# Altium project 24V 20CH ESP32 Actuator Controller.PrjPcb (part 1 of 2)
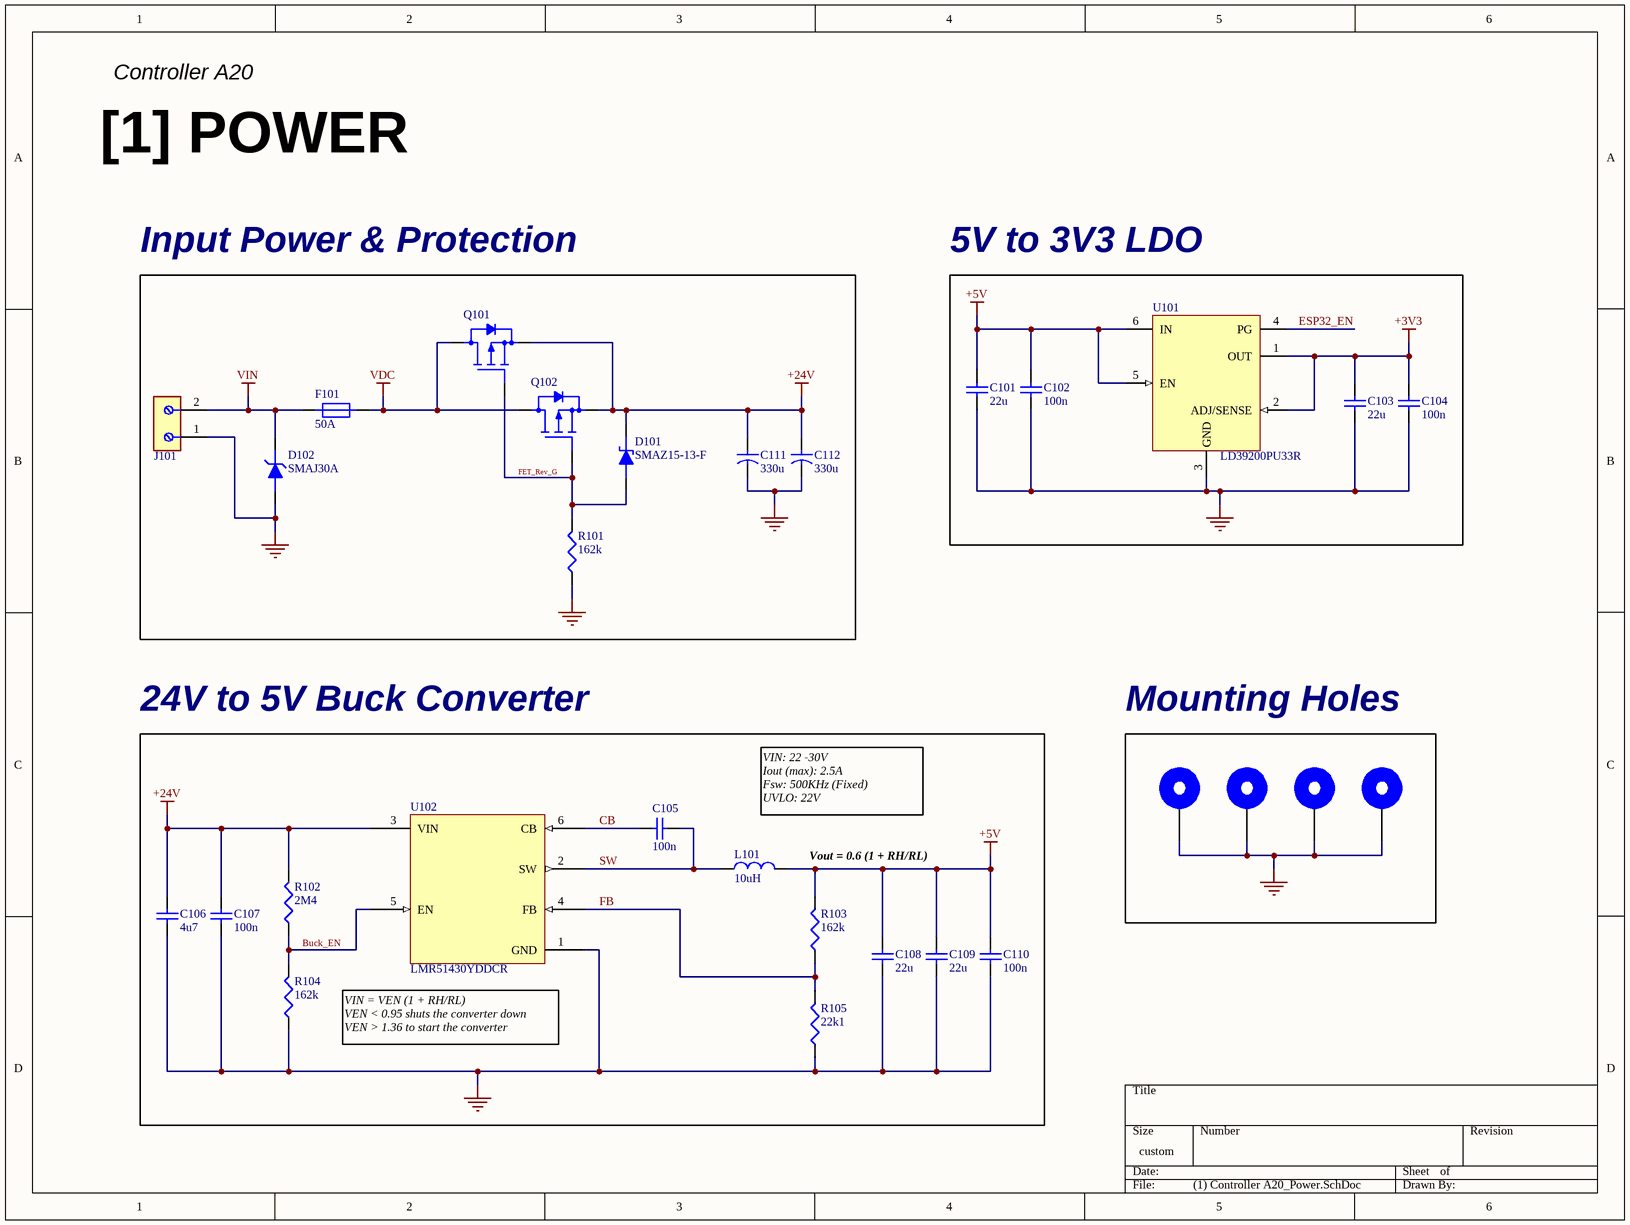
[diagram p0: (1) Controller A20_Power.SchDoc]
6 sheets, 205 parts. Net scope: global (net labels, ports and power ports of the same name join across sheets).
Board file: Controller A20.PcbDoc
Sheets:
  (1) Controller A20_Power.SchDoc
  (2) Controller A20_ESP32.SchDoc
  (3) Controller A20_Ethernet.SchDoc
  (4) Controller A20_BUFFERs.SchDoc
  (5) Controller A20_SSRs.SchDoc
  (6) Controller A20_OUTPUT.SchDoc

## Sheet (1) Controller A20_Power.SchDoc
size 304 x 228 mm; SheetNumber: 1; SheetTotal: 6

### Parts
C101  22u  [C0805]
C102  100n  [C0603]
C103  22u  [C0805]
C104  100n  [C0603]
C105  100n  [C0603]
C106  4u7  [C0805]
C107  100n  [C0603]
C108  22u  [C0805]
C109  22u  [C0805]
C110  100n  [C0603]
C111  330u  [SMD CAP,D10.3xL10.3mm]
C112  330u  [SMD CAP,D10.3xL10.3mm]
D101  SMAZ15-13-F  [DO-214AC(SMA)]
D102  SMAJ30A  [DO-214AC(SMA)]
F101  50A  [SMD Fuse,12.2 x 4.5 x 4.5 mm]
J101  691256610002  [10.16mm 2P STB]  (value not drawn)
J102  Mounting Hole D6mm H3mm  [MH D6mm H3mm]  (value not drawn)
J103  Mounting Hole D6mm H3mm  [MH D6mm H3mm]  (value not drawn)
J104  Mounting Hole D6mm H3mm  [MH D6mm H3mm]  (value not drawn)
J105  Mounting Hole D6mm H3mm  [MH D6mm H3mm]  (value not drawn)
L101  10uH  [L SMD 6.8x6.6]
Q101  XPH3R114MC,L1XHQ  [8-SOP Advance (5x5)]  (value not drawn)
Q102  XPH3R114MC,L1XHQ  [8-SOP Advance (5x5)]  (value not drawn)
R101  162k  [R0603]
R102  2M4  [R0603]
R103  162k  [R0603]
R104  162k  [R0603]
R105  22k1  [R0603]
U101  LD39200PU33R  [DFN-6(3x3)]
U102  LMR51430YDDCR  [SOT-23-6]

### Blocks framed on the sheet
Input Power & Protection: C111 C112 D101 D102 F101 J101 Q101 Q102 R101
5V to 3V3 LDO: C101-C104 U101
24V to 5V Buck Converter: C105-C110 L101 R102-R105 U102
Mounting Holes: J102-J105

### Nets
+3V3: C103.2 C104.2 U101.1(OUT) U101.2(ADJ/SENSE)
+5V: C101.2 C102.2 C108.2 C109.2 C110.2 L101.2 R103.2 U101.5(EN) U101.6(IN)
+24V: C106.2 C107.2 C111.1 C112.1 D101.2 Q101.1 Q102.1 R102.2 U102.3(VIN)
GND: C101.1 C102.1 C103.1 C104.1 C106.1 C107.1 C108.1 C109.1 C110.1 C111.2 C112.2 D102.1 J101.1 J102.1 J103.1 J104.1 J105.1 R101.1 R104.1 R105.1 U101.3(GND) U102.1(GND)
VDC: F101.1 Q101.5 Q102.5
VIN: D102.2 F101.2 J101.2
Buck_EN: R102.1 R104.2 U102.5(EN)
CB: C105.1 U102.6(CB)
ESP32_EN: U101.4(PG)
FB: R103.1 R105.2 U102.4(FB)
FET_Rev_G: D101.1 Q101.4 Q102.4 R101.2
SW: C105.2 L101.1 U102.2(SW)

### Notes on the sheet
- Controller A20
- [1] POWER
- VIN: 22 -30V
  Iout (max): 2.5A
  Fsw: 500KHz (Fixed)
  UVLO: 22V
- (near L101) Vout = 0.6 (1 + RH/RL)
- VIN = VEN (1 + RH/RL)
  VEN < 0.95 shuts the converter down
  VEN > 1.36 to start the converter

### Library data of the parts
C101 C103 C108 C109 = CAP 22uF 25V: 22 µF ±20% 25V Ceramic Capacitor X5R 0805 (2012 Metric); Manufacturer: Samsung Electro-Mechanics; Mfr. Part #: CL21A226MAYNNNE; Qty.: 10; Ext. Price: 0.43; Supplier: DigiKey; Supplier Part #: 1276-CL21A226MAYNNNECT-ND; Package: 0805; Unit Price: 0.043; ComponentLink1Description: Datasheet; ComponentLink1URL: https://mm.digikey.com/Volume0/opasdata/d220001/medias/docus/339/CL21A226MAYNNNE_Spec.pdf; ComponentLink2Description: Distributor Link; ComponentLink2URL: https://www.digikey.com/en/products/detail/samsung-electro-mechanics/CL21A226MAYNNNE/10479857
C102 C104 C105 C107 C110 = CAP 100nF 50V: 0.1 µF ±10% 50V Ceramic Capacitor X7R 0603 (1608 Metric); Manufacturer: KEMET; Mfr. Part #: C0603C104K5RACTU; Qty.: 10; Ext. Price: 0.11; Supplier: DigiKey; Supplier Part #: 399-C0603C104K5RACTUCT-ND; Package: 0603; Unit Price: 0.011; ComponentLink1Description: Datasheet; ComponentLink1URL: https://www.yageogroup.com/content/datasheet/asset/file/KEM_C1002_X7R_SMD; ComponentLink2Description: Distributor Link; ComponentLink2URL: https://www.digikey.com/en/products/detail/kemet/C0603C104K5RACTU/1465594
C106 = CAP 4.7uF 50V: 4.7 µF ±20% 50V Ceramic Capacitor X7R 0805 (2012 Metric); Manufacturer: Murata Electronics; Mfr. Part #: GRM21BZ71H475ME15K; Qty.: 1; Ext. Price: 0.27; Supplier: DigiKey; Supplier Part #: 490-GRM21BZ71H475ME15KCT-ND; Package: 0805; Unit Price: 0.27; ComponentLink1Description: Datasheet; ComponentLink1URL: https://search.murata.co.jp/Ceramy/image/img/A01X/G101/ENG/GRM21BZ71H475ME15-01.pdf; ComponentLink2Description: Distributor Link; ComponentLink2URL: https://www.digikey.com/en/products/detail/murata-electronics/GRM21BZ71H475ME15K/13904866
C111 C112 = Electrolytic CAP 330uF 50V: 330 µF 50 V Aluminum Electrolytic Capacitors Radial, Can - SMD 2000 Hrs @ 105°C; Manufacturer: Nichicon; Mfr. Part #: UCM1H331MNL1GS; Qty.: 1; Ext. Price: 1.18; Supplier: DigiKey; Supplier Part #: 493-14535-1-ND; Package: SMD,D10.3xL10.3mm; Unit Price: 1.18; ComponentLink1Description: Datasheet; ComponentLink1URL: https://www.nichicon.co.jp/english/series_items/catalog_pdf/e-ucm.pdf; ComponentLink2Description: Distributor Link; ComponentLink2URL: https://www.digikey.com/en/products/detail/nichicon/UCM1H331MNL1GS/4991858
D101 = SMAZ15-13-F 15V Zener Diode: Zener Diode 15 V 1 W ±5% Surface Mount SMA; Manufacturer: Diodes Incorporated; Qty.: 1; Ext. Price: 0.28; Mfr. Part #: SMAZ15-13-F; Supplier: DigiKey; Supplier Part #: SMAZ15-FDICT-ND; Package: DO-214AC(SMA); Unit Price: 0.28; ComponentLink1Description: Datasheet; ComponentLink1URL: https://www.diodes.com/assets/Datasheets/ds18015.pdf; ComponentLink2Description: Distributor Link; ComponentLink2URL: https://www.digikey.com/en/products/detail/diodes-incorporated/SMAZ15-13-F/775753
D102 = SMAJ30A TVS Diode 30VRWM: 48.4V Clamp 8.3A Ipp Tvs Diode Surface Mount DO-214AC; Manufacturer: Würth Elektronik; Qty.: 1; Ext. Price: 0.29; Mfr. Part #: SMAJ30A; Supplier: DigiKey; Supplier Part #: 732-SMAJ30ACT-ND; Package: DO-214AC(SMA); Unit Price: 0.29; ComponentLink1Description: Datasheet; ComponentLink1URL: https://www.we-online.com/components/products/datasheet/824500301.pdf; ComponentLink2Description: Distributor Link; ComponentLink2URL: https://www.digikey.com/en/products/detail/w%C3%BCrth-elektronik/SMAJ30A/5870799
F101 = 0456050.DRSDE Fuse 50A: 50 A 250 V 80 V Fuse Board Mount (Cartridge Style Excluded) Surface Mount 2-SMD, Square End Block; Manufacturer: Littelfuse Inc.; Qty.: 1; Ext. Price: 6.13; Mfr. Part #: 0456050.DRSDE; Supplier: DigiKey; Supplier Part #: 18-0456050.DRSDECT-ND; Package: SMD,12.2 x 4.5 x 4.5 mm; Unit Price: 6.13; ComponentLink1Description: Datasheet; ComponentLink1URL: https://www.littelfuse.com/assetdocs/littelfuse-nano2-fuse-456sde-series-datasheet?assetguid=a4746110-f339-4e5a-85ce-ce23fbd88349; ComponentLink2Description: Distributor Link; ComponentLink2URL: https://www.digikey.com/en/products/detail/littelfuse-inc/0456050-DRSDE/14005839
J101 = Terminal Block 2P 57A: 2 Position Wire to Board Terminal Block Horizontal with Board 0.400" (10.16mm) Through Hole; Manufacturer: Würth Elektronik; Qty.: 1; Ext. Price: 3.36; Mfr. Part #: 691256610002; Supplier: DigiKey; Supplier Part #: 732-11031-ND; Package: Through Hole, P=10.16mm; Unit Price: 3.36; ComponentLink1Description: Datasheet; ComponentLink1URL: https://www.we-online.com/components/products/datasheet/691256610002.pdf; ComponentLink2Description: Distributor Link; ComponentLink2URL: https://www.digikey.com/en/products/detail/w%C3%BCrth-elektronik/691256610002/6644127
L101 = 10uH 7A Inductor: 10 µH Shielded Inductor 7 A 29.82mOhm Max Nonstandard; Manufacturer: Pulse Electronics; Mfr. Part #: PM5432.103NLT; Qty.: 1; Ext. Price: 1.83; Supplier: DigiKey; Supplier Part #: 553-PM5432.103NLTCT-ND; Package: SMD, 6.8x6.6; Unit Price: 1.83; ComponentLink1Description: Datasheet; ComponentLink1URL: https://www.yageogroup.com/content/datasheet/asset/file/DATASHEET_P890; ComponentLink2Description: Distributor Link; ComponentLink2URL: https://www.digikey.com/en/products/detail/pulse-electronics/PM5432-103NLT/13693950
Q101 Q102 = MOSFET P-CH 40V 100A: P-Channel 40 V 100A (Ta) 960mW (Ta), 170W (Tc) Surface Mount 8-SOP Advance (5x5); Manufacturer: Toshiba Semiconductor and Storage; Qty.: 1; Ext. Price: 1.82; Mfr. Part #: XPH3R114MC,L1XHQ; Supplier: DigiKey; Supplier Part #: 264-XPH3R114MCL1XHQCT-ND; Package: 8-SOP Advance (5x5); Unit Price: 1.82; ComponentLink1Description: Datasheet; ComponentLink1URL: https://toshiba.semicon-storage.com/info/XPH3R114MC_datasheet_en_20241216.pdf?did=63639&prodName=XPH3R114MC; ComponentLink2Description: Distributor Link; ComponentLink2URL: https://www.digikey.com/en/products/detail/toshiba-semiconductor-and-storage/XPH3R114MC-L1XHQ/12155003
R101 R103 R104 = RES 162k: 162 kOhms ±1% 0.1W, 1/10W Chip Resistor 0603 (1608 Metric) Moisture Resistant Thick Film; Manufacturer: YAGEO; Mfr. Part #: RC0603FR-07162KL; Qty.: 10; Ext. Price: 0.06; Supplier: DigiKey; Supplier Part #: 311-162KHRCT-ND; Package: 0603; Unit Price: 0.006; ComponentLink1Description: Datasheet; ComponentLink1URL: https://www.yageogroup.com/content/datasheet/asset/file/PYU-RT_1-TO-0-01_ROHS_L; ComponentLink2Description: Distributor Link; ComponentLink2URL: https://www.digikey.com/en/products/detail/yageo/RC0603FR-07162KL/726975
R102 = RES 2.4M: 2.4 MOhms ±1% 0.1W, 1/10W Chip Resistor 0603 (1608 Metric) Moisture Resistant Thick Film; Manufacturer: YAGEO; Mfr. Part #: RC0603FR-072M4L; Qty.: 10; Ext. Price: 0.11; Supplier: DigiKey; Supplier Part #: 13-RC0603FR-072M4LCT-ND; Package: 0603; Unit Price: 0.011; ComponentLink1Description: Datasheet; ComponentLink1URL: https://www.yageogroup.com/content/datasheet/asset/file/PYU-RT_1-TO-0-01_ROHS_L; ComponentLink2Description: Distributor Link; ComponentLink2URL: https://www.digikey.com/en/products/detail/yageo/RC0603FR-072M4L/5918310
R105 = RES 22.1k: 22.1 kOhms ±1% 0.1W, 1/10W Chip Resistor 0603 (1608 Metric) Thin Film; Manufacturer: YAGEO; Mfr. Part #: RT0603FRE0722K1L; Qty.: 10; Ext. Price: 0.14; Supplier: DigiKey; Supplier Part #: 13-RT0603FRE0722K1LCT-ND; Package: 0603; Unit Price: 0.014; ComponentLink1Description: Datasheet; ComponentLink1URL: https://www.yageogroup.com/content/datasheet/asset/file/PYU-RT_1-TO-0-01_ROHS_L; ComponentLink2Description: Distributor Link; ComponentLink2URL: https://www.digikey.com/en/products/detail/yageo/RT0603FRE0722K1L/1075211
U101 = LDO 3V3 2A: Linear Voltage Regulator IC Positive Fixed 1 Output 2A 6-DFN (3x3); Manufacturer: STMicroelectronics; Qty.: 1; Ext. Price: 1.05; Mfr. Part #: LD39200PU33R; Supplier: DigiKey; Supplier Part #: 497-15229-1-ND; Package: DFN-6(3x3); Unit Price: 1.05; ComponentLink1Description: Datasheet; ComponentLink1URL: https://www.st.com/content/ccc/resource/technical/document/datasheet/4b/e6/2e/a4/16/04/46/9d/DM00102135.pdf/files/DM00102135.pdf/jcr:content/translations/en.DM00102135.pdf; ComponentLink2Description: Distributor Link; ComponentLink2URL: https://www.digikey.com/en/products/detail/stmicroelectronics/LD39200PU33R/5131797
U102 = LMR51430YDDCR Buck Converter: Buck Switching Regulator IC Positive Adjustable 0.6V 1 Output 3A SOT-23-6 Thin, TSOT-23-6; Manufacturer: Texas Instruments; Qty.: 1; Ext. Price: 1.58; Mfr. Part #: LMR51430YDDCR; Supplier: DigiKey; Supplier Part #: 296-LMR51430YDDCRCT-ND; Package: TSOT-23-6; Unit Price: 1.58; ComponentLink1Description: Datasheet; ComponentLink1URL: https://www.ti.com/lit/ds/symlink/lmr51430.pdf; ComponentLink2Description: Distributor Link; ComponentLink2URL: https://www.digikey.com/en/products/detail/texas-instruments/LMR51430YDDCR/17878361?s=N4IgTCBcDaIDIFkBKBWAjAFgMwAYCaAIgQMJIgC6AvkA

## Sheet (2) Controller A20_ESP32.SchDoc
size 355 x 228 mm; SheetNumber: 2; SheetTotal: 6
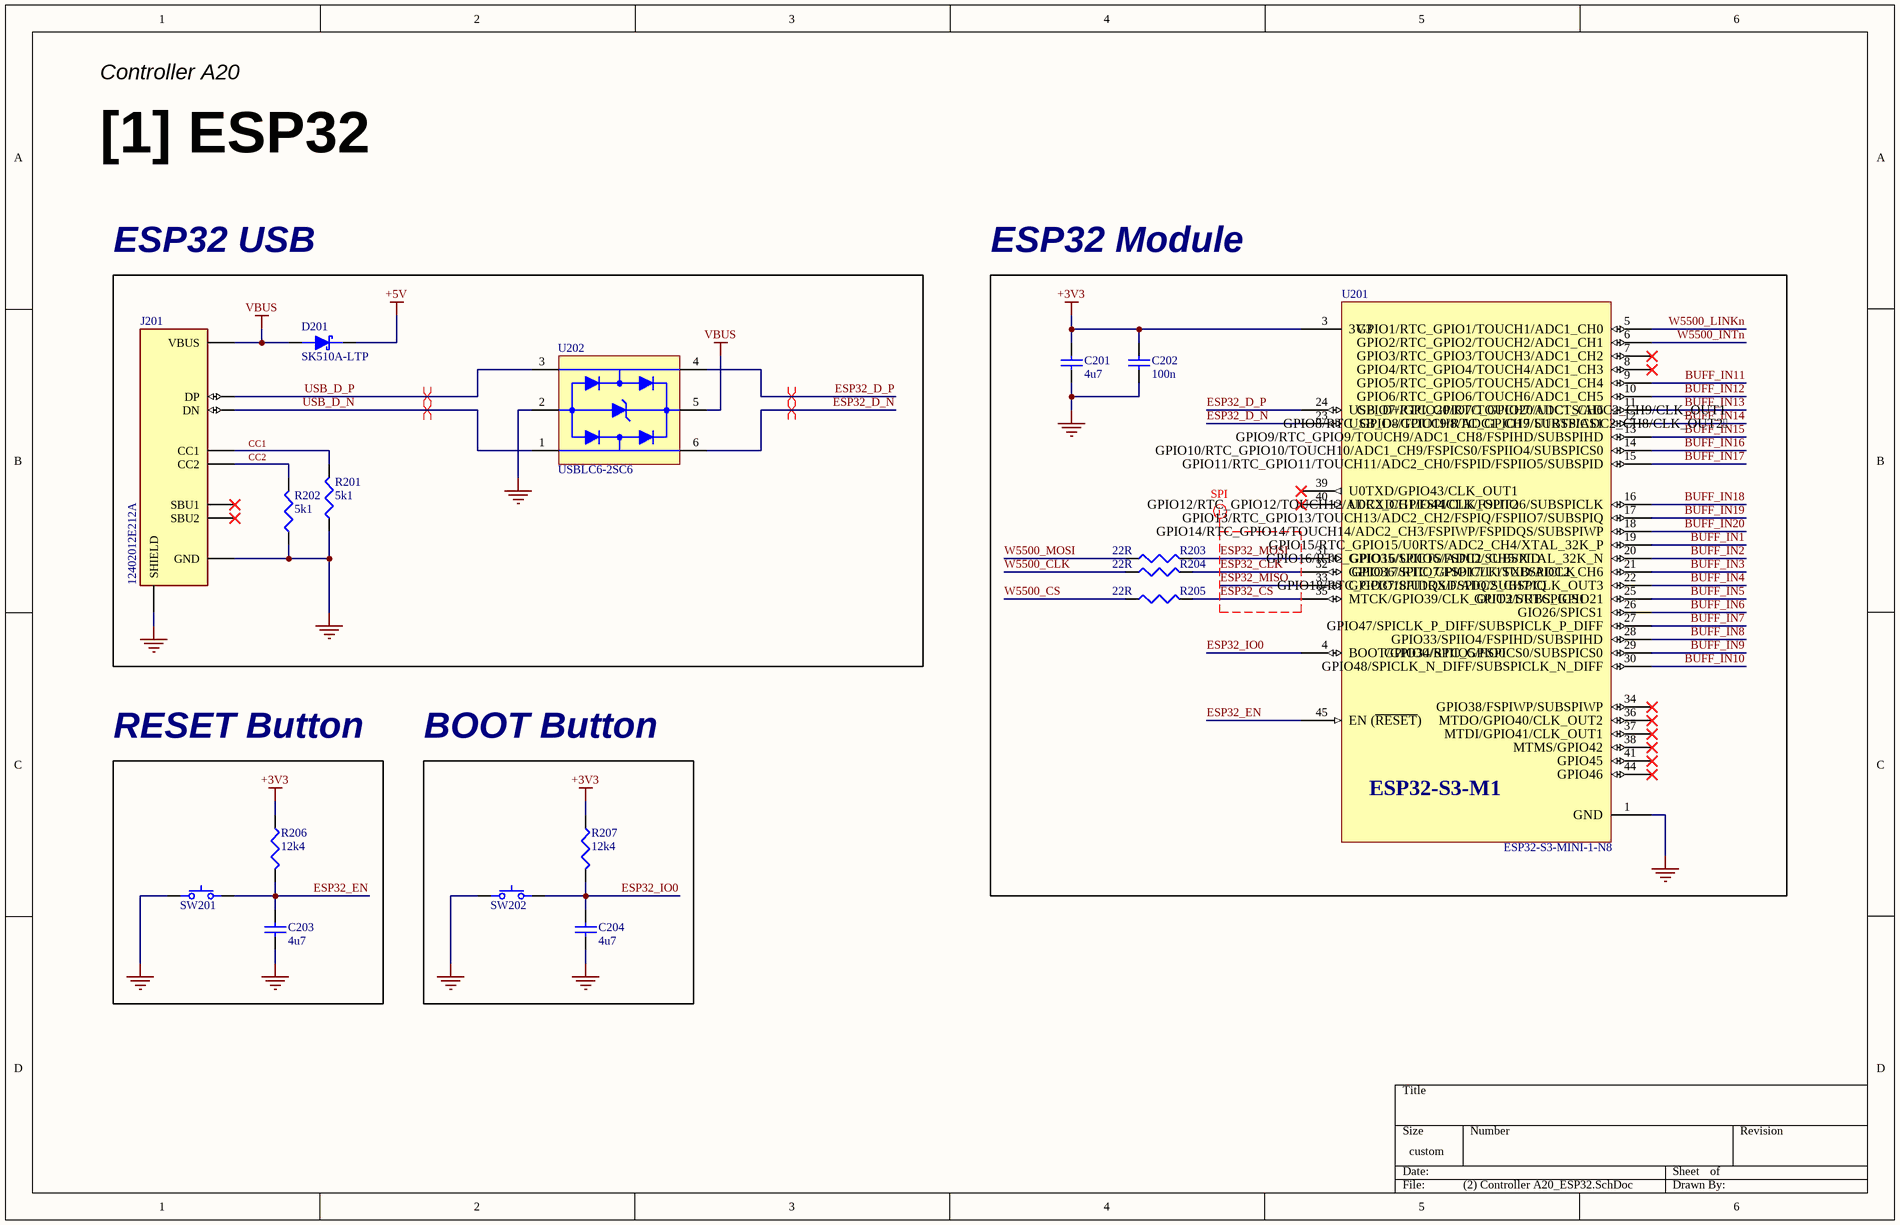
[diagram p1: (2) Controller A20_ESP32.SchDoc]

### Parts
C201  4u7  [C0805]
C202  100n  [C0603]
C203  4u7  [C0805]
C204  4u7  [C0805]
D201  SK510A-LTP  [DO-214AC(SMA)]
J201  12402012E212A  [USB-C Female 16P]
R201  5k1  [R0603]
R202  5k1  [R0603]
R203  22R  [R0402]
R204  22R  [R0402]
R205  22R  [R0402]
R206  12k4  [R0603]
R207  12k4  [R0603]
SW201  SKRPANE010  [SMD Tactile Switch]  (value not drawn)
SW202  SKRPANE010  [SMD Tactile Switch]  (value not drawn)
U201  ESP32-S3-MINI-1-N8  [ESP32-S3-MINI-1-N8]
U202  USBLC6-2SC6  [SOT23-6L]

### Blocks framed on the sheet
ESP32 USB: D201 J201 R201 R202 U202
ESP32 Module: C201 C202 R203-R205 U201
RESET Button: C203 R206 SW201
BOOT Button: C204 R207 SW202

### Nets
+3V3: C201.2 C202.2 R206.2 R207.2 U201.3(3V3)
+5V: D201.2
GND: C201.1 C202.1 C203.1 C204.1 J201.A1B12/B1A12(GND) J201.SH(SHIELD) R201.1 R202.1 SW201.2 SW202.2 U201.1(GND) U202.2
VBUS: D201.1 J201.A4B9/_B4A9(VBUS) U202.5
BUFF_IN1: U201.19(GPIO15/RTC_GPIO15/U0RTS/ADC2_CH4/XTAL_32K_P)
BUFF_IN2: U201.20(GPIO16/RTC_GPIO16/U0CTS/ADC2_CH5/XTAL_32K_N)
BUFF_IN3: U201.21(GPIO17/RTC_GPIO17/U1TXD/ADC2_CH6)
BUFF_IN4: U201.22(GPIO18/RTC_GPIO18/U1RXD/ADC2_CH7/CLK_OUT3)
BUFF_IN5: U201.25(GPIO21/RTC_GPIO21)
BUFF_IN6: U201.26(GIO26/SPICS1)
BUFF_IN7: U201.27(GPIO47/SPICLK_P_DIFF/SUBSPICLK_P_DIFF)
BUFF_IN8: U201.28(GPIO33/SPIIO4/FSPIHD/SUBSPIHD)
BUFF_IN9: U201.29(GPIO34/SPIIO5/FSPICS0/SUBSPICS0)
BUFF_IN10: U201.30(GPIO48/SPICLK_N_DIFF/SUBSPICLK_N_DIFF)
BUFF_IN11: U201.9(GPIO5/RTC_GPIO5/TOUCH5/ADC1_CH4)
BUFF_IN12: U201.10(GPIO6/RTC_GPIO6/TOUCH6/ADC1_CH5)
BUFF_IN13: U201.11(GPIO7/RTC_GPIO7/TOUCH7/ADC1_CH6)
BUFF_IN14: U201.12(GPIO8/RTC_GPIO8/TOUCH8/ADC1_CH7/SUBSPICS1)
BUFF_IN15: U201.13(GPIO9/RTC_GPIO9/TOUCH9/ADC1_CH8/FSPIHD/SUBSPIHD)
BUFF_IN16: U201.14(GPIO10/RTC_GPIO10/TOUCH10/ADC1_CH9/FSPICS0/FSPIIO4/SUBSPICS0)
BUFF_IN17: U201.15(GPIO11/RTC_GPIO11/TOUCH11/ADC2_CH0/FSPID/FSPIIO5/SUBSPID)
BUFF_IN18: U201.16(GPIO12/RTC_GPIO12/TOUCH12/ADC2_CH1/FSPICLK/FSPIIO6/SUBSPICLK)
BUFF_IN19: U201.17(GPIO13/RTC_GPIO13/TOUCH13/ADC2_CH2/FSPIQ/FSPIIO7/SUBSPIQ)
BUFF_IN20: U201.18(GPIO14/RTC_GPIO14/TOUCH14/ADC2_CH3/FSPIWP/FSPIDQS/SUBSPIWP)
CC1: J201.A5(CC1) R201.2
CC2: J201.B5(CC2) R202.2
ESP32_CLK: R204.2 U201.32(GPIO36/SPIIO7/FSPICLK/SUBSPICLK)
ESP32_CS: R205.2 U201.35(MTCK/GPIO39/CLK_OUT3/SUBSPICS1)
ESP32_D_N: U201.23(USB_D-/GPIO19/RTC_GPIO19/U1RTS/ADC2_CH8/CLK_OUT2) U202.6
ESP32_D_P: U201.24(USB_D+/GPIO20/RTC_GPIO20/U1CTS/ADC2_CH9/CLK_OUT1) U202.4
ESP32_EN: C203.2 R206.1 SW201.1 U201.45(EN_(~{RESET}))
ESP32_IO0: C204.2 R207.1 SW202.1 U201.4(BOOT/GPIO0/RTC_GPIO0)
ESP32_MISO: U201.33(GPIO37/SPIDQS/FSPIQ/SUBSPIQ)
ESP32_MOSI: R203.2 U201.31(GPIO35/SPIIO6/FSPID/SUBSPID)
USB_D_N: J201.A7/B7(DN) U202.1
USB_D_P: J201.A6/B6(DP) U202.3
W5500_CLK: R204.1
W5500_CS: R205.1
W5500_INTn: U201.6(GPIO2/RTC_GPIO2/TOUCH2/ADC1_CH1)
W5500_LINKn: U201.5(GPIO1/RTC_GPIO1/TOUCH1/ADC1_CH0)
W5500_MOSI: R203.1

Not connected (* = marked no-connect by the designer): J201 A8(SBU1)* B8(SBU2)*; U201 7(GPIO3/RTC_GPIO3/TOUCH3/ADC1_CH2)* 8(GPIO4/RTC_GPIO4/TOUCH4/ADC1_CH3)* 34(GPIO38/FSPIWP/SUBSPIWP)* 36(MTDO/GPIO40/CLK_OUT2)* 37(MTDI/GPIO41/CLK_OUT1)* 38(MTMS/GPIO42)* 39(U0TXD/GPIO43/CLK_OUT1)* 40(U0RXD/GPIO44/CLK_OUT2)* 41(GPIO45)* 44(GPIO46)*

### Layout directives
differential pair; differential pair class USB90: USB_D_P
differential pair; differential pair class USB90; rule Impedance Constraint [Min = 85.00    Max = 95.00    ]: ESP32_D_N, ESP32_D_P, USB_D_N, USB_D_P
rule Impedance Constraint [Min = 45.00    Max = 55.00    ]; net class SPI: ESP32_CLK, ESP32_CS, ESP32_MISO, ESP32_MOSI

### Notes on the sheet
- Controller A20
- [1] ESP32
- (in symbol ESP32-S3-MINI-1-N8) ESP32-S3-M1

### Library data of the parts
C201 C203 C204 = CAP 4.7uF 50V: as C106 on sheet (1) Controller A20_Power; Supplier: DigiKey; Supplier Part #: 490-GRM21BZ71H475ME15KCT-ND; Package: 0805; Unit Price: 0.27; ComponentLink1Description: Datasheet; ComponentLink1URL: https://search.murata.co.jp/Ceramy/image/img/A01X/G101/ENG/GRM21BZ71H475ME15-01.pdf; ComponentLink2Description: Distributor Link; ComponentLink2URL: https://www.digikey.com/en/products/detail/murata-electronics/GRM21BZ71H475ME15K/13904866
C202 = CAP 100nF 50V: as C102 on sheet (1) Controller A20_Power; Supplier: DigiKey; Supplier Part #: 399-C0603C104K5RACTUCT-ND; Package: 0603; Unit Price: 0.011; ComponentLink1Description: Datasheet; ComponentLink1URL: https://www.yageogroup.com/content/datasheet/asset/file/KEM_C1002_X7R_SMD; ComponentLink2Description: Distributor Link; ComponentLink2URL: https://www.digikey.com/en/products/detail/kemet/C0603C104K5RACTU/1465594
D201 = SK510A-LTP 100V 5A Schottky Diode: Diode 100 V 5A Surface Mount DO-214AC (SMA); Manufacturer: MCC (Micro Commercial Components); Qty.: 1; Ext. Price: 0.5; Mfr. Part #: SK510A-LTP; Supplier: DigiKey; Supplier Part #: SK510A-LTPMSCT-ND; Package: DO-214AC(SMA); Unit Price: 0.5; ComponentLink1Description: Datasheet; ComponentLink1URL: https://www.mccsemi.com/pdf/Products/SK52A-L_SK5200A-L(SMA).pdf; ComponentLink2Description: Distributor Link; ComponentLink2URL: https://www.digikey.com/en/products/detail/mcc-micro-commercial-components/SK510A-LTP/5114130
J201 = USB2.0 Type-C Connector: USB-C (USB TYPE-C) USB 2.0 Receptacle Connector 24 (16+8 Dummy) Position Surface Mount, Right Angle; Through Hole; Manufacturer: Amphenol ICC (Commercial Products); Qty.: 1; Ext. Price: 0.61; Mfr. Part #: 12402012E212A; Supplier: DigiKey; Supplier Part #: 664-12402012E212ACT-ND; Package: SMD; Unit Price: 0.61; ComponentLink1Description: Datasheet; ComponentLink1URL: https://cdn.amphenol-cs.com/media/wysiwyg/files/drawing/12402012-10.pdf; ComponentLink2Description: Distributor Link; ComponentLink2URL: https://www.digikey.com/en/products/detail/amphenol-cs-commercial-products/12402012E212A/13683192?s=N4IgTCBcDaIIxgCwAYzIQUTAggiAugL5A
R201 R202 = RES 5.1k: 5.1 kOhms ±1% 0.1W, 1/10W Chip Resistor 0603 (1608 Metric) Moisture Resistant Thick Film; Manufacturer: YAGEO; Mfr. Part #: RC0603FR-075K1L; Qty.: 10; Ext. Price: 0.07; Supplier: DigiKey; Supplier Part #: 311-5.10KHRCT-ND; Package: 0603; Unit Price: 0.007; ComponentLink1Description: Datasheet; ComponentLink1URL: https://www.yageogroup.com/content/datasheet/asset/file/PYU-RC_GROUP_51_ROHS_L; ComponentLink2Description: Distributor Link; ComponentLink2URL: https://www.digikey.com/en/products/detail/yageo/RC0603FR-075K1L/727268
R203-R205 = RES 22R: 22 Ohms ±1% 0.063W, 1/16W Chip Resistor 0402 (1005 Metric) Moisture Resistant Thick Film; Manufacturer: YAGEO; Mfr. Part #: RC0402FR-0722RL; Qty.: 10; Ext. Price: 0.07; Supplier: DigiKey; Supplier Part #: 311-22.0LRCT-ND; Package: 0402; Unit Price: 0.007; ComponentLink1Description: Datasheet; ComponentLink1URL: https://www.yageogroup.com/content/datasheet/asset/file/PYU-RC_GROUP_51_ROHS_L; ComponentLink2Description: Distributor Link; ComponentLink2URL: https://www.digikey.com/en/products/detail/yageo/RC0402FR-0722RL/726562
R206 R207 = RES 12.4k: 12.4 kOhms ±1% 0.1W, 1/10W Chip Resistor 0603 (1608 Metric) Moisture Resistant Thick Film; Manufacturer: YAGEO; Mfr. Part #: RC0603FR-0712K4L; Qty.: 10; Ext. Price: 0.07; Supplier: DigiKey; Supplier Part #: 311-12.4KHRCT-ND; Package: 0603; Unit Price: 0.007; ComponentLink1Description: Datasheet; ComponentLink1URL: https://www.yageogroup.com/content/datasheet/asset/file/PYU-RT_1-TO-0-01_ROHS_L; ComponentLink2Description: Distributor Link; ComponentLink2URL: https://www.digikey.com/en/products/detail/yageo/RC0603FR-0712K4L/726917
SW201 SW202 = Tactile Switch: Without Bracket 3.2mm 2.5mm Oval Button Surface Mount,Vertical 4.2mm SPST 1,000,000 Cycles 16V 1.57N SMD Tactile Switches ROHS; Manufacturer: ALPSALPINE; Qty.: 1; Ext. Price: 0.27; Mfr. Part #: SKRPANE010; Supplier: DigiKey; Supplier Part #: 4809-SKRPANE010CT-ND; Package: SMD; Unit Price: 0.27; ComponentLink1Description: Datasheet; ComponentLink1URL: https://tech.alpsalpine.com/cms.media/product_spec_skrpane010_en_1e0076b4ef.pdf; ComponentLink2Description: Distributor Link; ComponentLink2URL: https://www.digikey.com/en/products/detail/alps-alpine/SKRPANE010/26519635?s=N4IgTCBcDaIMoGkBKAFAggOQKIAYCMOIAugL5A
U201 = ESP32-S3-MINI-1-N8: Small-sized module supporting 2.4 GHz Wi-Fi (802.11b/g/n) and Bluetooth® 5 / Built around ESP32-S3 series of SoCs, Xtensa® dual-core 32-bit LX7 microprocessor. / Flash up to 8 MB, optional 2 MB PSRAM in chip package. / 39 GPIOs, rich set of peripherals; Manufacturer: Espressif Systems; Qty.: 1; Ext. Price: 5.28; Mfr. Part #: ESP32-S3-MINI-1-N8; Supplier: DigiKey; Supplier Part #: 5407-ESP32-S3-MINI-1-N8CT-ND; Package: SMD; Unit Price: 5.28; ComponentLink1Description: Datasheet; ComponentLink1URL: https://documentation.espressif.com/esp32-s3-mini-1_mini-1u_datasheet_en.pdf; ComponentLink2Description: Distributor Link; ComponentLink2URL: https://www.digikey.com/en/products/detail/espressif-systems/ESP32-S3-MINI-1-N8/15295890
U202 = USBLC6-2SC6 ESD Array 5.25VRWM: 17V Clamp 5A (8/20µs) Ipp Tvs Diode Surface Mount SOT-23-6; Manufacturer: STMicroelectronics; Qty.: 1; Ext. Price: 0.36; Mfr. Part #: USBLC6-2SC6; Supplier: DigiKey; Supplier Part #: 497-5235-1-ND; Package: SOT-23-6L; Unit Price: 0.36; ComponentLink1Description: Datasheet; ComponentLink1URL: https://www.st.com/content/ccc/resource/technical/document/datasheet/06/1d/48/9c/6c/20/4a/b2/CD00050750.pdf/files/CD00050750.pdf/jcr:content/translations/en.CD00050750.pdf; ComponentLink2Description: Distributor Link; ComponentLink2URL: https://www.digikey.com/en/products/detail/stmicroelectronics/USBLC6-2SC6/1040559

## Sheet (3) Controller A20_Ethernet.SchDoc
size 482 x 241 mm; SheetNumber: 3; SheetTotal: 6
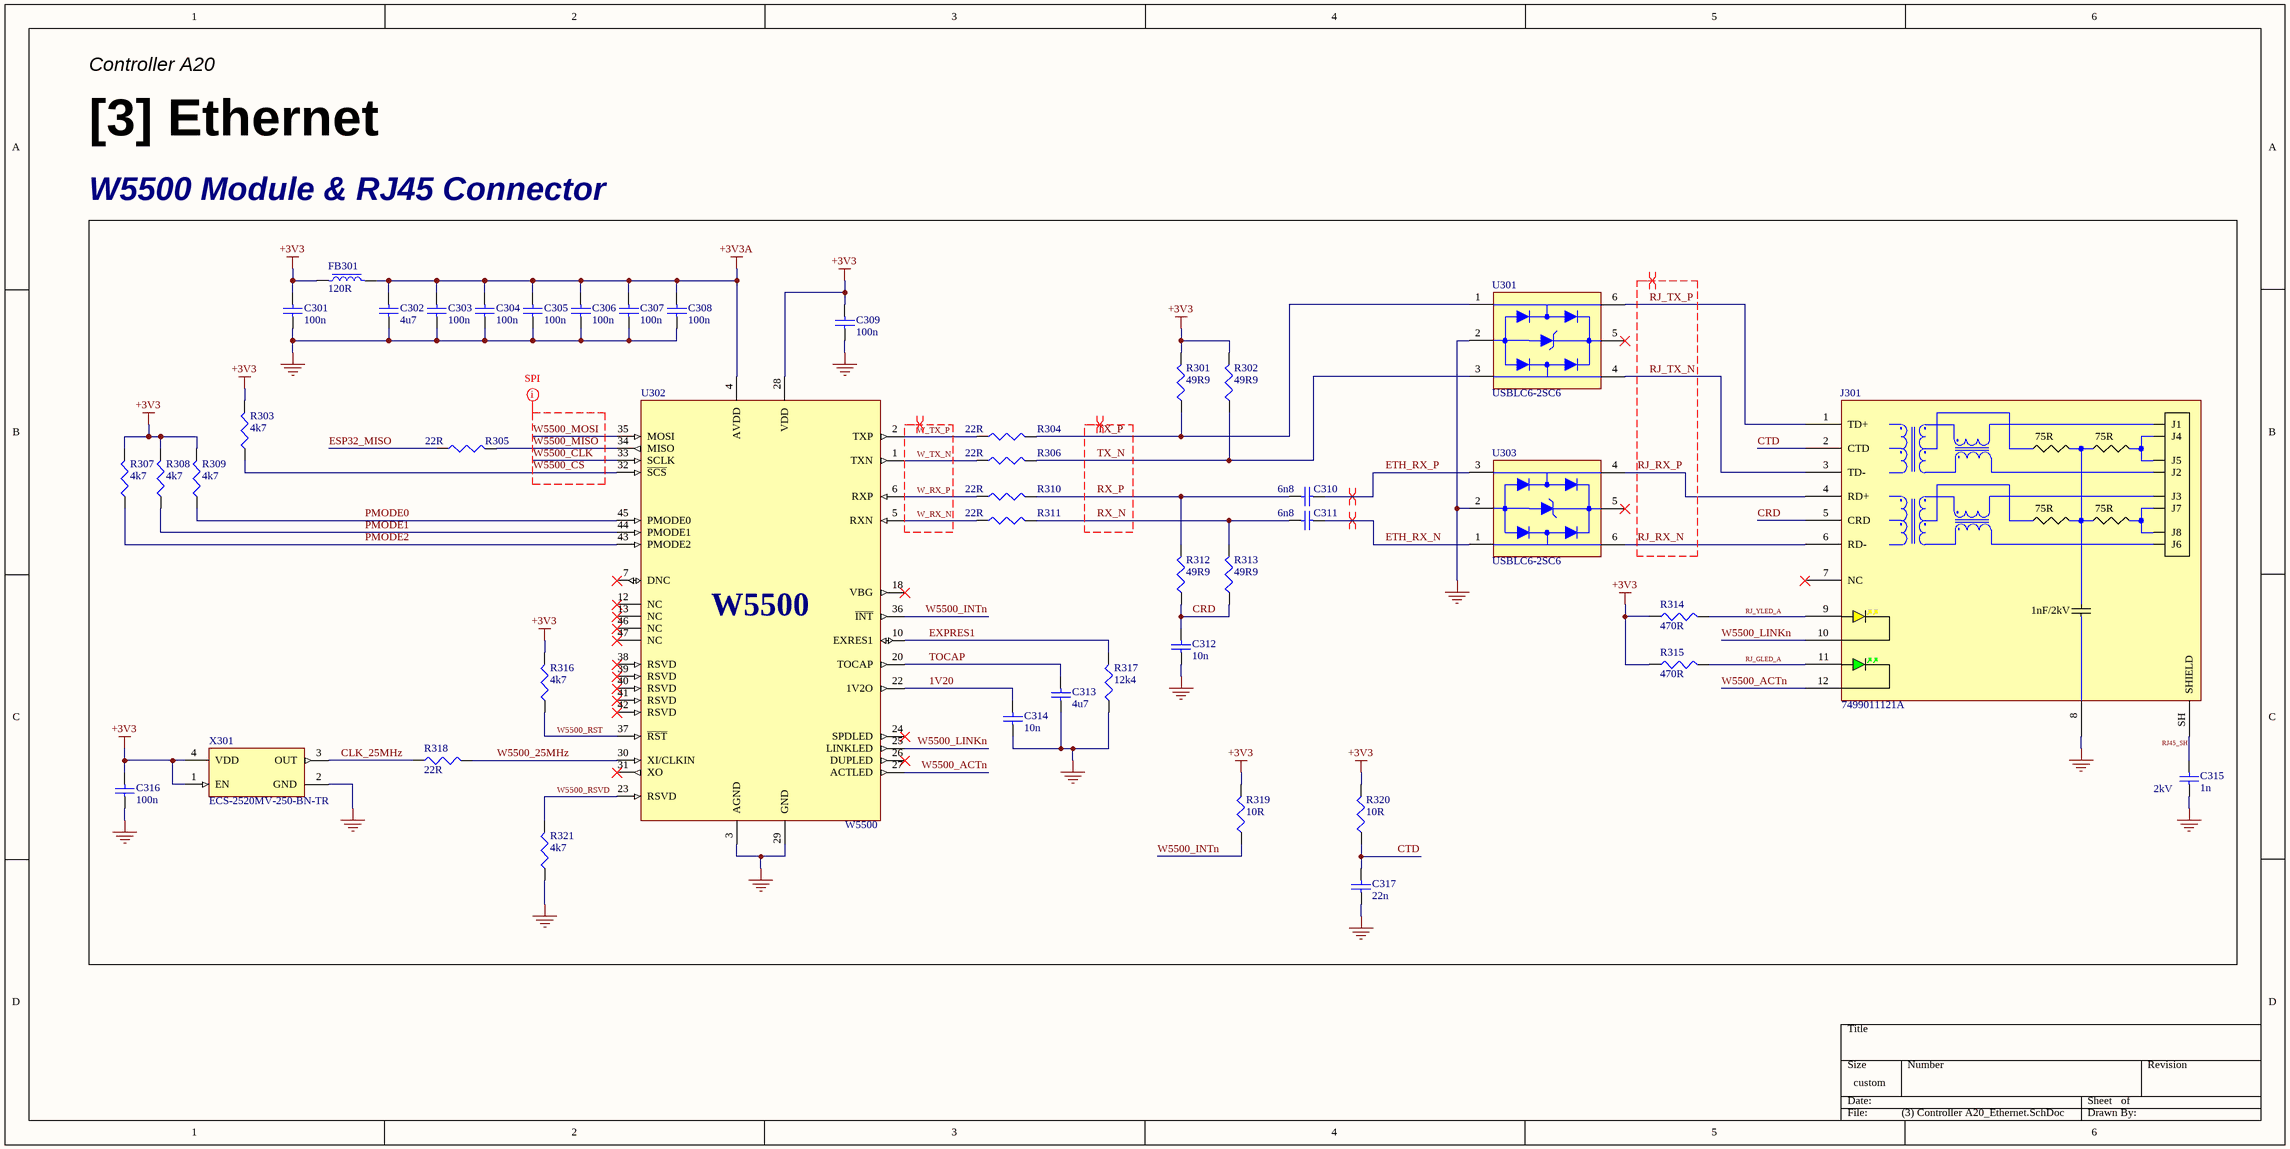
[diagram p2: (3) Controller A20_Ethernet.SchDoc]

### Parts
C301  100n  [C0603]
C302  4u7  [C0805]
C303  100n  [C0603]
C304  100n  [C0603]
C305  100n  [C0603]
C306  100n  [C0603]
C307  100n  [C0603]
C308  100n  [C0603]
C309  100n  [C0603]
C310  6n8  [C0402]
C311  6n8  [C0402]
C312  10n  [C0402]
C313  4u7  [C0805]
C314  10n  [C0402]
C315  1n  [C1206]
C316  100n  [C0603]
C317  22n  [C0402]
FB301  120R  [FB0402]
J301  7499011121A  [RJ45 TH Connector]
R301  49R9  [R0402]
R302  49R9  [R0402]
R303  4k7  [R0603]
R304  22R  [R0402]
R305  22R  [R0402]
R306  22R  [R0402]
R307  4k7  [R0603]
R308  4k7  [R0603]
R309  4k7  [R0603]
R310  22R  [R0402]
R311  22R  [R0402]
R312  49R9  [R0402]
R313  49R9  [R0402]
R314  470R  [R0603]
R315  470R  [R0603]
R316  4k7  [R0603]
R317  12k4  [R0603]
R318  22R  [R0402]
R319  10R  [R0402]
R320  10R  [R0402]
R321  4k7  [R0603]
U301  USBLC6-2SC6  [SOT23-6L]
U302  W5500  [LQFP-48(7x7)]
U303  USBLC6-2SC6  [SOT23-6L]
X301  ECS-2520MV-250-BN-TR  [SMD2520-4P]

### Nets
+3V3: C301.2 C309.2 C316.2 FB301.1 R301.2 R302.2 R303.2 R307.2 R308.2 R309.2 R314.1 R315.1 R316.2 R319.2 R320.2 U302.28(VDD) X301.1(EN) X301.4(VDD)
+3V3A: C302.2 C303.2 C304.2 C305.2 C306.2 C307.2 C308.2 FB301.2 U302.4(AVDD)
GND: C301.1 C302.1 C303.1 C304.1 C305.1 C306.1 C307.1 C308.1 C309.1 C312.1 C313.1 C314.1 C315.1 C316.1 C317.1 J301.8 R317.1 R321.1 U301.2 U302.3(AGND) U302.29(GND) U303.2 X301.2(GND)
1V20: C314.2 U302.22(1V2O)
CLK_25MHz: R318.1 X301.3(OUT)
CRD: C312.2 J301.5(CRD) R312.1 R313.1
CTD: C317.2 J301.2(CTD) R320.1
ESP32_MISO: R305.1
ETH_RX_N: C311.2 U303.1
ETH_RX_P: C310.2 U303.3
EXPRES1: R317.2 U302.10(EXRES1)
PMODE0: R309.1 U302.45(PMODE0)
PMODE1: R308.1 U302.44(PMODE1)
PMODE2: R307.1 U302.43(PMODE2)
RJ45_SH: C315.2 J301.SH(SHIELD)
RJ_GLED_A: J301.11(G_LED_A) R315.2
RJ_RX_N: J301.6(RD-) U303.6
RJ_RX_P: J301.4(RD+) U303.4
RJ_TX_N: J301.3(TD-) U301.4
RJ_TX_P: J301.1(TD+) U301.6
RJ_YLED_A: J301.9(Y_LED_A) R314.2
RX_N: C311.1 R311.2 R313.2
RX_P: C310.1 R310.2 R312.2
TOCAP: C313.2 U302.20(TOCAP)
TX_N: R302.1 R306.2 U301.3
TX_P: R301.1 R304.2 U301.1
W5500_25MHz: R318.2 U302.30(XI/CLKIN)
W5500_ACTn: J301.12(G_LED_K) U302.27(ACTLED)
W5500_CLK: U302.33(SCLK)
W5500_CS: R303.1 U302.32(~{SCS})
W5500_INTn: R319.1 U302.36(~{INT})
W5500_LINKn: J301.10(Y_LED_K) U302.25(LINKLED)
W5500_MISO: R305.2 U302.34(MISO)
W5500_MOSI: U302.35(MOSI)
W5500_RST: R316.1 U302.37(~{RST})
W5500_RSVD: R321.2 U302.23(RSVD)
W_RX_N: R311.1 U302.5(RXN)
W_RX_P: R310.1 U302.6(RXP)
W_TX_N: R306.1 U302.1(TXN)
W_TX_P: R304.1 U302.2(TXP)

Not connected (* = marked no-connect by the designer): J301 7(NC)*; U301 5*; U302 7(DNC)* 12(NC)* 13(NC)* 18(VBG)* 24(SPDLED)* 26(DUPLED)* 31(XO)* 38(RSVD)* 39(RSVD)* 40(RSVD)* 41(RSVD)* 42(RSVD)* 46(NC)* 47(NC)*; U303 5*

### Layout directives
differential pair; differential pair class ETH100; rule Matched Net Lengths [Delay Tolerance = 20ps]: ETH_RX_N, ETH_RX_P, RJ_RX_N, RJ_RX_P, RJ_TX_N, RJ_TX_P, RX_N, RX_P, TX_N, TX_P, W_RX_N, W_RX_P, W_TX_N, W_TX_P
rule Impedance Constraint [Min = 45.00    Max = 55.00    ]; net class SPI: W5500_CLK, W5500_CS, W5500_MISO, W5500_MOSI

### Notes on the sheet
- Controller A20
- [3] Ethernet
- W5500 Module & RJ45 Connector
- (near C315) 2kV
- (in symbol 7499011121A RJ45 Connector) J1; 75R; J4; J5; J2; J3; J7; J8; J6; 1nF/2kV

### Library data of the parts
C301 C303-C309 C316 = CAP 100nF 50V: as C102 on sheet (1) Controller A20_Power; Supplier: DigiKey; Supplier Part #: 399-C0603C104K5RACTUCT-ND; Package: 0603; Unit Price: 0.011; ComponentLink1Description: Datasheet; ComponentLink1URL: https://www.yageogroup.com/content/datasheet/asset/file/KEM_C1002_X7R_SMD; ComponentLink2Description: Distributor Link; ComponentLink2URL: https://www.digikey.com/en/products/detail/kemet/C0603C104K5RACTU/1465594
C302 C313 = CAP 4.7uF 50V: as C106 on sheet (1) Controller A20_Power; Supplier: DigiKey; Supplier Part #: 490-GRM21BZ71H475ME15KCT-ND; Package: 0805; Unit Price: 0.27; ComponentLink1Description: Datasheet; ComponentLink1URL: https://search.murata.co.jp/Ceramy/image/img/A01X/G101/ENG/GRM21BZ71H475ME15-01.pdf; ComponentLink2Description: Distributor Link; ComponentLink2URL: https://www.digikey.com/en/products/detail/murata-electronics/GRM21BZ71H475ME15K/13904866
C310 C311 = CAP 6.8nF 100V: 6800 pF ±10% 100V Ceramic Capacitor X7R 0402 (1005 Metric); Manufacturer: Samsung Electro-Mechanics; Mfr. Part #: CL05B682KC5VPNC; Qty.: 10; Ext. Price: 0.49; Supplier: DigiKey; Supplier Part #: 1276-CL05B682KC5VPNCCT-ND; Package: 0402; Unit Price: 0.049; ComponentLink1Description: Datasheet; ComponentLink1URL: https://mm.digikey.com/Volume0/opasdata/d220001/medias/docus/5458/CL05B682KC5VPNC_Spec.pdf; ComponentLink2Description: Distributor Link; ComponentLink2URL: https://www.digikey.com/en/products/detail/samsung-electro-mechanics/CL05B682KC5VPNC/20498579
C312 C314 = CAP 10nF 50V: 10000 pF ±10% 50V Ceramic Capacitor X7R 0402 (1005 Metric); Manufacturer: KEMET; Mfr. Part #: C0402C103K5REC7411; Qty.: 10; Ext. Price: 0.56; Supplier: DigiKey; Supplier Part #: 399-C0402C103K5REC7411CT-ND; Package: 0402; Unit Price: 0.056; ComponentLink1Description: Datasheet; ComponentLink1URL: https://www.yageogroup.com/content/datasheet/asset/file/KEM_C1090_X7R_ESD; ComponentLink2Description: Distributor Link; ComponentLink2URL: https://www.digikey.com/en/products/detail/kemet/C0402C103K5REC7411/8645041
C315 = CAP 1nF 2kV: 2kV 1nF X7R ±10% 1206 Multilayer Ceramic Capacitors MLCC - SMD/SMT ROHS; Manufacturer: Johanson Dielectrics; Mfr. Part #: 202R18W102KV4E; Qty.: 1; Ext. Price: 0.17; Supplier: DigiKey; Supplier Part #: 709-VPDD202W102K1GV001ECT-ND; Package: 1206; Unit Price: 0.17; ComponentLink1Description: Datasheet; ComponentLink2Description: Distributor Link; ComponentLink2URL: https://www.digikey.com/en/products/detail/johanson-dielectrics-inc/VPDD202W102K1GV001E/1556359?s=N4IgTCBcDa4AxgEoEYAcB1ZCDSA1ALAKIgC6AvkA
C317 = CAP 22nF 50V: 0.022 µF ±10% 50V Ceramic Capacitor X7R 0402 (1005 Metric); Manufacturer: YAGEO; Mfr. Part #: CC0402KRX7R9BB223; Qty.: 10; Ext. Price: 0.29; Supplier: DigiKey; Supplier Part #: 311-1722-1-ND; Package: 0402; Unit Price: 0.029; ComponentLink1Description: Datasheet; ComponentLink1URL: https://www.yageogroup.com/content/datasheet/asset/file/UPY-GPHC_X7R_6_3V-TO-250V; ComponentLink2Description: Distributor Link; ComponentLink2URL: https://www.digikey.com/en/products/detail/yageo/CC0402KRX7R9BB223/5195131
FB301 = BLM15PX121SN1D Ferrite Bead 120Ω: 120 Ohms @ 100 MHz 1 Power Line Ferrite Bead 0402 (1005 Metric) 2A 55mOhm; Manufacturer: Murata Electronics; Qty.: 1; Ext. Price: 0.1; Mfr. Part #: BLM15PX121SN1D; Supplier: DigiKey; Supplier Part #: 490-9656-1-ND; Package: 0402; Unit Price: 0.1; ComponentLink1Description: Datasheet; ComponentLink1URL: https://www.murata.com/en-us/products/productdata/8796740059166/ENFA0018.pdf; ComponentLink2Description: Distributor Link; ComponentLink2URL: https://www.digikey.com/en/products/detail/murata-electronics/BLM15PX121SN1D/4421095?s=N4IgTCBcDaIEIBkCyBGArABQBorCgygHIoAiIAugL5A
J301 = 7499011121A RJ45 Connector: 1 Port RJ45 with Magnetics Through Hole 10/100 Base-T, AutoMDIX; Manufacturer: Würth Elektronik; Qty.: 1; Ext. Price: 6.55; Mfr. Part #: 7499011121A; Supplier: DigiKey; Supplier Part #: 732-4509-5-ND; Package: Through Hole; Unit Price: 6.55; ComponentLink1Description: Datasheet; ComponentLink1URL: https://www.we-online.com/components/products/datasheet/7499011121A.pdf; ComponentLink2Description: Distributor Link; ComponentLink2URL: https://www.digikey.com/en/products/detail/w%C3%BCrth-elektronik/7499011121A/4031599
R301 R302 R312 R313 = RES 49.9R: 49.9 Ohms ±1% 0.063W, 1/16W Chip Resistor 0402 (1005 Metric) Moisture Resistant Thick Film; Manufacturer: YAGEO; Mfr. Part #: RC0402FR-0749R9L; Qty.: 10; Ext. Price: 0.2; Supplier: DigiKey; Supplier Part #: 311-49.9LRCT-ND; Package: 0402; Unit Price: 0.02; ComponentLink1Description: Datasheet; ComponentLink1URL: https://www.yageogroup.com/content/datasheet/asset/file/PYU-RC_GROUP_51_ROHS_L; ComponentLink2Description: Distributor Link; ComponentLink2URL: https://www.digikey.com/en/products/detail/yageo/RC0402FR-0749R9L/726621
R303 R307-R309 R316 R321 = RES 4.7k: 4.7 kOhms ±1% 0.1W, 1/10W Chip Resistor 0603 (1608 Metric) Moisture Resistant Thick Film; Manufacturer: YAGEO; Mfr. Part #: RC0603FR-074K7L; Qty.: 10; Ext. Price: 0.09; Supplier: DigiKey; Supplier Part #: 311-4.70KHRCT-ND; Package: 0603; Unit Price: 0.009; ComponentLink1Description: Datasheet; ComponentLink1URL: https://www.yageogroup.com/content/datasheet/asset/file/PYU-RC_GROUP_51_ROHS_L; ComponentLink2Description: Distributor Link; ComponentLink2URL: https://www.digikey.com/en/products/detail/yageo/RC0603FR-074K7L/727212
R304-R306 R310 R311 R318 = RES 22R: as R203 on sheet (2) Controller A20_ESP32; Supplier: DigiKey; Supplier Part #: 311-22.0LRCT-ND; Package: 0402; Unit Price: 0.007; ComponentLink1Description: Datasheet; ComponentLink1URL: https://www.yageogroup.com/content/datasheet/asset/file/PYU-RC_GROUP_51_ROHS_L; ComponentLink2Description: Distributor Link; ComponentLink2URL: https://www.digikey.com/en/products/detail/yageo/RC0402FR-0722RL/726562
R314 R315 = RES 470R: 470 Ohms ±1% 0.1W, 1/10W Chip Resistor 0603 (1608 Metric) Thin Film; Manufacturer: YAGEO; Mfr. Part #: RT0603FRE07470RL; Qty.: 10; Ext. Price: 0.1; Supplier: DigiKey; Supplier Part #: YAG5742CT-ND; Package: 0603; Unit Price: 0.01; ComponentLink1Description: Datasheet; ComponentLink1URL: https://www.yageogroup.com/content/datasheet/asset/file/PYU-RT_1-TO-0-01_ROHS_L; ComponentLink2Description: Distributor Link; ComponentLink2URL: https://www.digikey.com/en/products/detail/yageo/RT0603FRE07470RL/1075383
R317 = RES 12.4k: as R206 on sheet (2) Controller A20_ESP32; Supplier: DigiKey; Supplier Part #: 311-12.4KHRCT-ND; Package: 0603; Unit Price: 0.007; ComponentLink1Description: Datasheet; ComponentLink1URL: https://www.yageogroup.com/content/datasheet/asset/file/PYU-RT_1-TO-0-01_ROHS_L; ComponentLink2Description: Distributor Link; ComponentLink2URL: https://www.digikey.com/en/products/detail/yageo/RC0603FR-0712K4L/726917
R319 R320 = RES 10R: 10 Ohms ±1% 0.063W, 1/16W Chip Resistor 0402 (1005 Metric) Automotive AEC-Q200, Moisture Resistant Thick Film; Manufacturer: YAGEO; Mfr. Part #: AC0402FR-0710RL; Qty.: 10; Ext. Price: 0.1; Supplier: DigiKey; Supplier Part #: YAG3438CT-ND; Package: 0402; Unit Price: 0.01; ComponentLink1Description: Datasheet; ComponentLink1URL: https://www.yageogroup.com/content/datasheet/asset/file/PYU-AC_51_ROHS_L; ComponentLink2Description: Distributor Link; ComponentLink2URL: https://www.digikey.com/en/products/detail/yageo/AC0402FR-0710RL/5895033
U301 U303 = USBLC6-2SC6 ESD Array 5.25VRWM: as U202 on sheet (2) Controller A20_ESP32; Mfr. Part #: USBLC6-2SC6; Supplier: DigiKey; Supplier Part #: 497-5235-1-ND; Package: SOT-23-6L; Unit Price: 0.36; ComponentLink1Description: Datasheet; ComponentLink1URL: https://www.st.com/content/ccc/resource/technical/document/datasheet/06/1d/48/9c/6c/20/4a/b2/CD00050750.pdf/files/CD00050750.pdf/jcr:content/translations/en.CD00050750.pdf; ComponentLink2Description: Distributor Link; ComponentLink2URL: https://www.digikey.com/en/products/detail/stmicroelectronics/USBLC6-2SC6/1040559
U302 = W5500 SPI to Ethernet: Ethernet Controller 10/100 Base-T/TX PHY SPI Interface 48-LQFP (7x7); Manufacturer: WIZnet; Qty.: 1; Ext. Price: 3.67; Mfr. Part #: W5500; Supplier: DigiKey; Supplier Part #: 1278-W5500CT-ND; Package: LQFP-48(7x7); Unit Price: 3.67; ComponentLink1Description: Datasheet; ComponentLink1URL: https://docs.wiznet.io/img/products/w5500/W5500_ds_v110e.pdf; ComponentLink2Description: Distributor Link; ComponentLink2URL: https://www.digikey.com/en/products/detail/wiznet/W5500/4425702
X301 = 25MHz HCMOS Oscillator: 25 MHz XO (Standard) HCMOS Oscillator 1.6V ~ 3.6V Enable/Disable 4-SMD, No Lead; Manufacturer: ECS Inc.; Qty.: 1; Ext. Price: 1.16; Mfr. Part #: ECS-2520MV-250-BN-TR; Supplier: DigiKey; Supplier Part #: XC2751CT-ND; Package: 4-SMD (2.5x2); Unit Price: 1.16; ComponentLink1Description: Datasheet; ComponentLink1URL: https://ecsxtal.com/store/pdf/ECS-2520MV.pdf; ComponentLink2Description: Distributor Link; ComponentLink2URL: https://www.digikey.com/en/products/detail/ecs-inc/ECS-2520MV-250-BN-TR/8593607?s=N4IgTCBcDaIKIGEDKBaMBWMAGAsgNTXSxQCEA5FAFQCUQBdAXyA

## Sheet (4) Controller A20_BUFFERs.SchDoc
size 330 x 241 mm; SheetNumber: 4; SheetTotal: 6
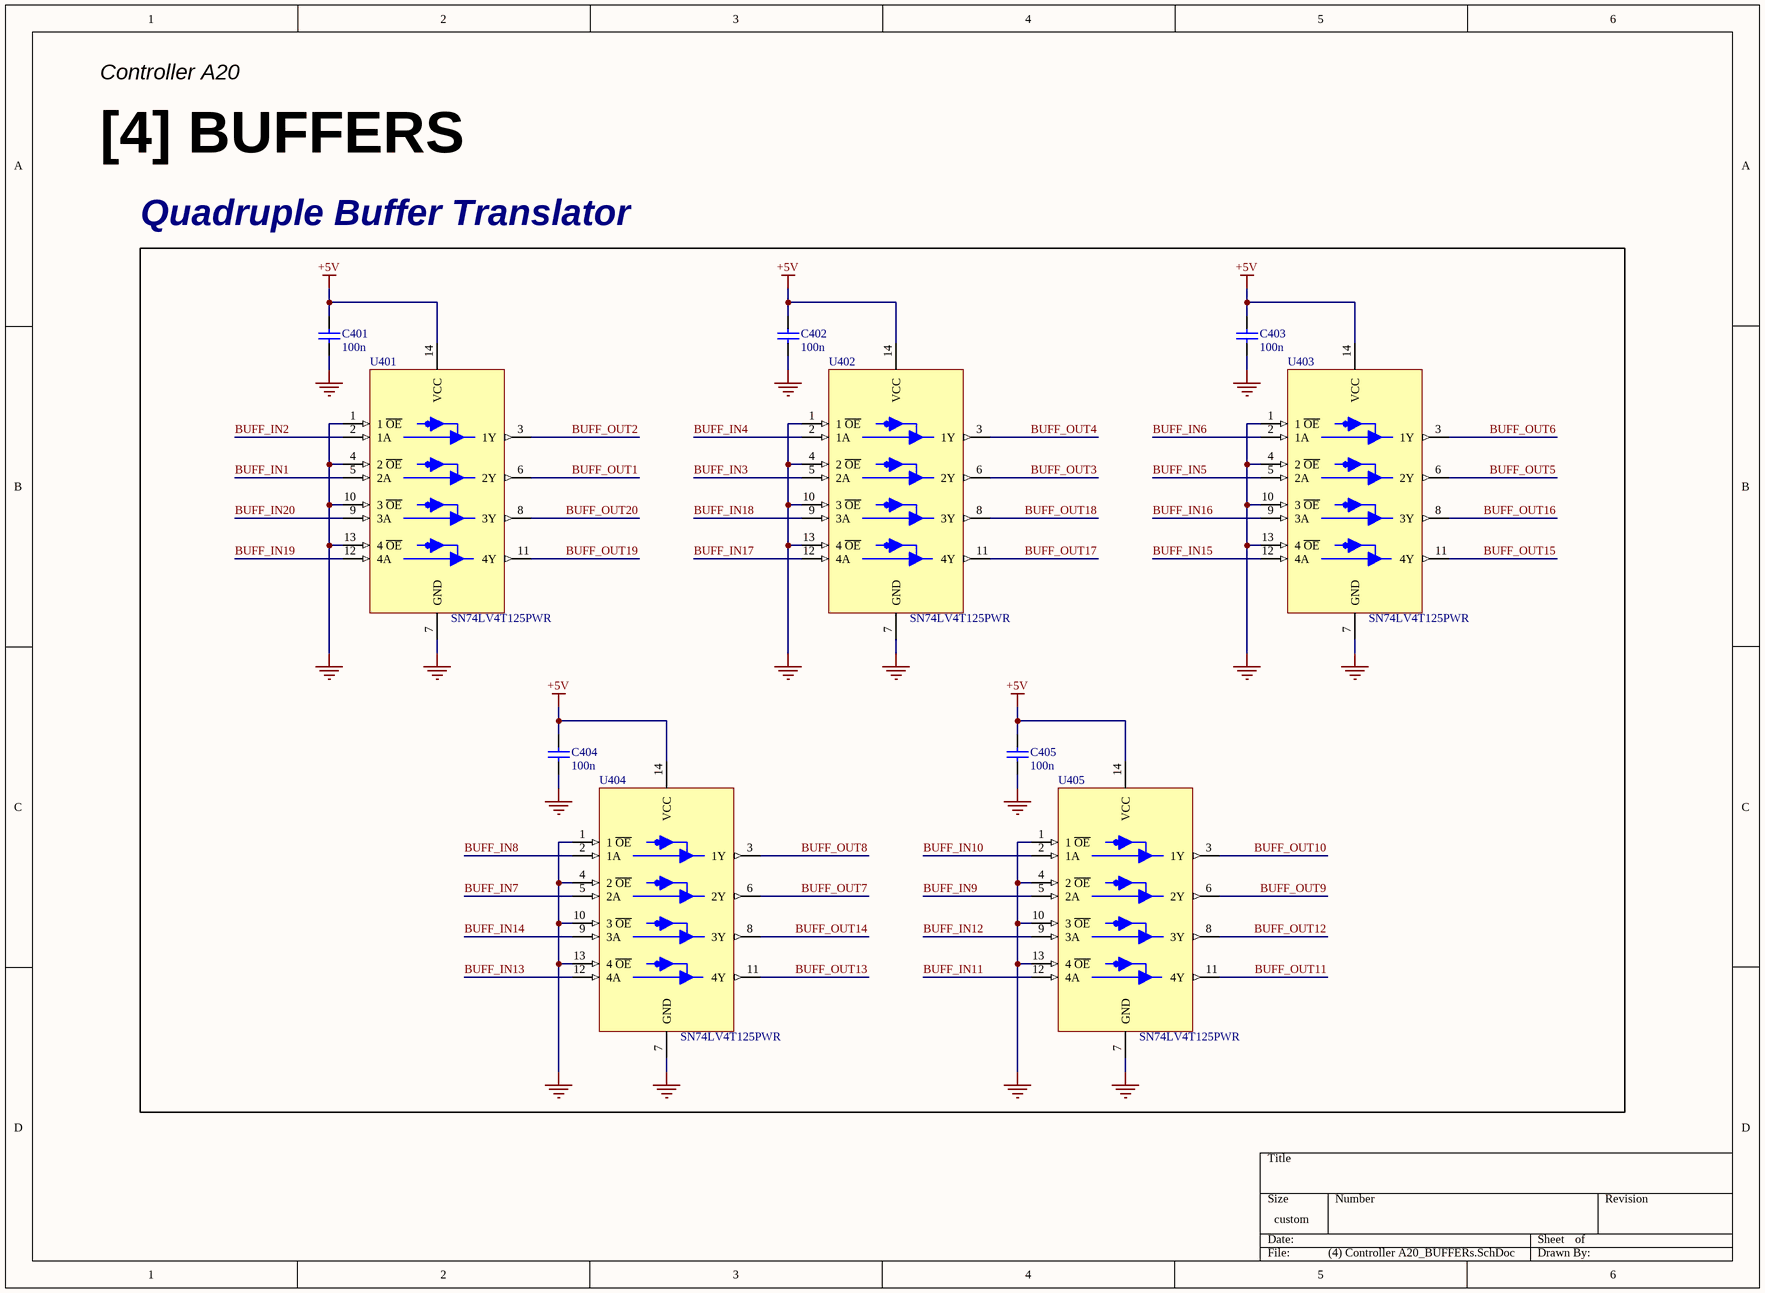
[diagram p3: (4) Controller A20_BUFFERs.SchDoc]

### Parts
C401  100n  [C0603]
C402  100n  [C0603]
C403  100n  [C0603]
C404  100n  [C0603]
C405  100n  [C0603]
U401  SN74LV4T125PWR  [14-TSSOP]
U402  SN74LV4T125PWR  [14-TSSOP]
U403  SN74LV4T125PWR  [14-TSSOP]
U404  SN74LV4T125PWR  [14-TSSOP]
U405  SN74LV4T125PWR  [14-TSSOP]

### Blocks framed on the sheet
Quadruple Buffer Translator: C401-C405 U401-U405

### Nets
+5V: C401.2 C402.2 C403.2 C404.2 C405.2 U401.14(VCC) U402.14(VCC) U403.14(VCC) U404.14(VCC) U405.14(VCC)
GND: C401.1 C402.1 C403.1 C404.1 C405.1 U401.1(1_~{OE}) U401.4(2_~{OE}) U401.7(GND) U401.10(3_~{OE}) U401.13(4_~{OE}) U402.1(1_~{OE}) U402.4(2_~{OE}) U402.7(GND) U402.10(3_~{OE}) U402.13(4_~{OE}) U403.1(1_~{OE}) U403.4(2_~{OE}) U403.7(GND) U403.10(3_~{OE}) U403.13(4_~{OE}) U404.1(1_~{OE}) U404.4(2_~{OE}) U404.7(GND) U404.10(3_~{OE}) U404.13(4_~{OE}) U405.1(1_~{OE}) U405.4(2_~{OE}) U405.7(GND) U405.10(3_~{OE}) U405.13(4_~{OE})
BUFF_IN1: U401.5(2A)
BUFF_IN2: U401.2(1A)
BUFF_IN3: U402.5(2A)
BUFF_IN4: U402.2(1A)
BUFF_IN5: U403.5(2A)
BUFF_IN6: U403.2(1A)
BUFF_IN7: U404.5(2A)
BUFF_IN8: U404.2(1A)
BUFF_IN9: U405.5(2A)
BUFF_IN10: U405.2(1A)
BUFF_IN11: U405.12(4A)
BUFF_IN12: U405.9(3A)
BUFF_IN13: U404.12(4A)
BUFF_IN14: U404.9(3A)
BUFF_IN15: U403.12(4A)
BUFF_IN16: U403.9(3A)
BUFF_IN17: U402.12(4A)
BUFF_IN18: U402.9(3A)
BUFF_IN19: U401.12(4A)
BUFF_IN20: U401.9(3A)
BUFF_OUT1: U401.6(2Y)
BUFF_OUT2: U401.3(1Y)
BUFF_OUT3: U402.6(2Y)
BUFF_OUT4: U402.3(1Y)
BUFF_OUT5: U403.6(2Y)
BUFF_OUT6: U403.3(1Y)
BUFF_OUT7: U404.6(2Y)
BUFF_OUT8: U404.3(1Y)
BUFF_OUT9: U405.6(2Y)
BUFF_OUT10: U405.3(1Y)
BUFF_OUT11: U405.11(4Y)
BUFF_OUT12: U405.8(3Y)
BUFF_OUT13: U404.11(4Y)
BUFF_OUT14: U404.8(3Y)
BUFF_OUT15: U403.11(4Y)
BUFF_OUT16: U403.8(3Y)
BUFF_OUT17: U402.11(4Y)
BUFF_OUT18: U402.8(3Y)
BUFF_OUT19: U401.11(4Y)
BUFF_OUT20: U401.8(3Y)

### Notes on the sheet
- Controller A20
- [4] BUFFERS

### Library data of the parts
C401-C405 = CAP 100nF 50V: as C102 on sheet (1) Controller A20_Power; Supplier: DigiKey; Supplier Part #: 399-C0603C104K5RACTUCT-ND; Package: 0603; Unit Price: 0.011; ComponentLink1Description: Datasheet; ComponentLink1URL: https://www.yageogroup.com/content/datasheet/asset/file/KEM_C1002_X7R_SMD; ComponentLink2Description: Distributor Link; ComponentLink2URL: https://www.digikey.com/en/products/detail/kemet/C0603C104K5RACTU/1465594
U401-U405 = SN74LV4T125PWR Non-Inverting Buffer: Buffer, Non-Inverting 4 Element 1 Bit per Element 3-State Output 14-TSSOP; Manufacturer: Texas Instruments; Qty.: 1; Ext. Price: 0.79; Mfr. Part #: SN74LV4T125PWR; Supplier: DigiKey; Supplier Part #: 296-40545-1-ND; Package: 14-TSSOP; Unit Price: 0.79; ComponentLink1Description: Datasheet; ComponentLink1URL: https://www.ti.com/lit/ds/symlink/sn74lv4t125.pdf?HQS=dis-dk-null-digikeymode-dsf-pf-null-wwe&ts=1762330787956&ref_url=https%253A%252F%252Fwww.ti.com%252Fgeneral%252Fdocs%252Fsuppproductinfo.tsp%253FdistId%253D10%2526gotoUrl%253Dhttps%253A%252F%252Fwww.ti.com%252Flit%252Fgpn%252Fsn74lv4t125; ComponentLink2Description: Distributor Link; ComponentLink2URL: https://www.digikey.com/en/products/detail/texas-instruments/SN74LV4T125PWR/4806529

## Sheet (5) Controller A20_SSRs.SchDoc
size 431 x 241 mm; SheetNumber: 5; SheetTotal: 6
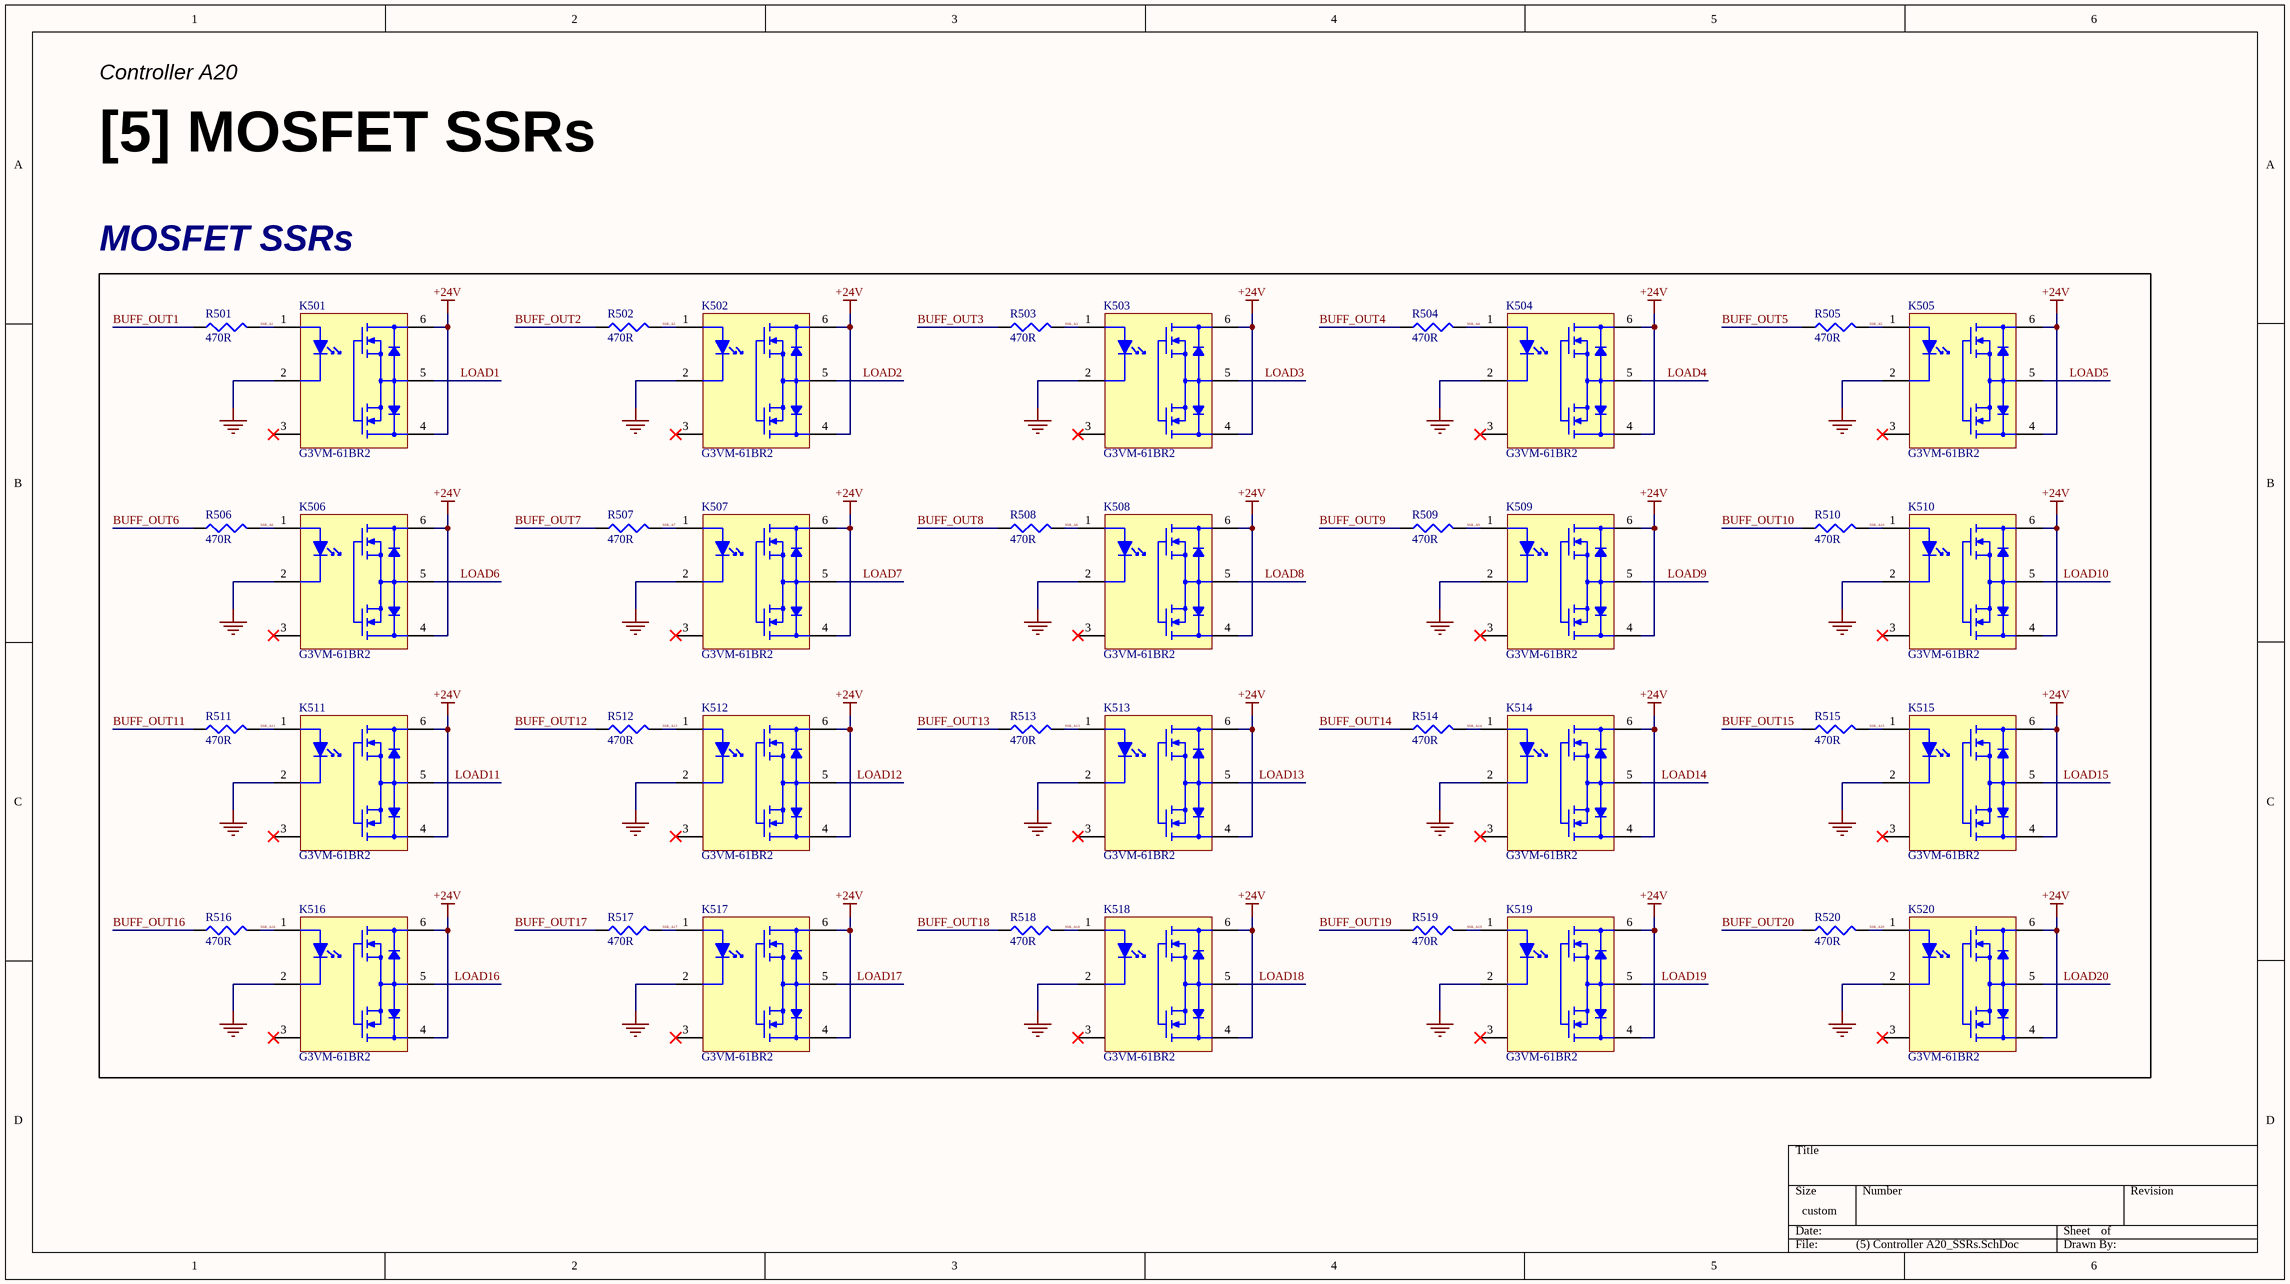
[diagram p4: (5) Controller A20_SSRs.SchDoc]

### Parts
K501  G3VM-61BR2  [DIP6]
K502  G3VM-61BR2  [DIP6]
K503  G3VM-61BR2  [DIP6]
K504  G3VM-61BR2  [DIP6]
K505  G3VM-61BR2  [DIP6]
K506  G3VM-61BR2  [DIP6]
K507  G3VM-61BR2  [DIP6]
K508  G3VM-61BR2  [DIP6]
K509  G3VM-61BR2  [DIP6]
K510  G3VM-61BR2  [DIP6]
K511  G3VM-61BR2  [DIP6]
K512  G3VM-61BR2  [DIP6]
K513  G3VM-61BR2  [DIP6]
K514  G3VM-61BR2  [DIP6]
K515  G3VM-61BR2  [DIP6]
K516  G3VM-61BR2  [DIP6]
K517  G3VM-61BR2  [DIP6]
K518  G3VM-61BR2  [DIP6]
K519  G3VM-61BR2  [DIP6]
K520  G3VM-61BR2  [DIP6]
R501  470R  [R0603]
R502  470R  [R0603]
R503  470R  [R0603]
R504  470R  [R0603]
R505  470R  [R0603]
R506  470R  [R0603]
R507  470R  [R0603]
R508  470R  [R0603]
R509  470R  [R0603]
R510  470R  [R0603]
R511  470R  [R0603]
R512  470R  [R0603]
R513  470R  [R0603]
R514  470R  [R0603]
R515  470R  [R0603]
R516  470R  [R0603]
R517  470R  [R0603]
R518  470R  [R0603]
R519  470R  [R0603]
R520  470R  [R0603]

### Blocks framed on the sheet
MOSFET SSRs: K501-K520 R501-R520

### Nets
+24V: K501.4 K501.6 K502.4 K502.6 K503.4 K503.6 K504.4 K504.6 K505.4 K505.6 K506.4 K506.6 K507.4 K507.6 K508.4 K508.6 K509.4 K509.6 K510.4 K510.6 K511.4 K511.6 K512.4 K512.6 K513.4 K513.6 K514.4 K514.6 K515.4 K515.6 K516.4 K516.6 K517.4 K517.6 K518.4 K518.6 K519.4 K519.6 K520.4 K520.6
GND: K501.2 K502.2 K503.2 K504.2 K505.2 K506.2 K507.2 K508.2 K509.2 K510.2 K511.2 K512.2 K513.2 K514.2 K515.2 K516.2 K517.2 K518.2 K519.2 K520.2
BUFF_OUT1: R501.1
BUFF_OUT2: R502.1
BUFF_OUT3: R503.1
BUFF_OUT4: R504.1
BUFF_OUT5: R505.1
BUFF_OUT6: R506.1
BUFF_OUT7: R507.1
BUFF_OUT8: R508.1
BUFF_OUT9: R509.1
BUFF_OUT10: R510.1
BUFF_OUT11: R511.1
BUFF_OUT12: R512.1
BUFF_OUT13: R513.1
BUFF_OUT14: R514.1
BUFF_OUT15: R515.1
BUFF_OUT16: R516.1
BUFF_OUT17: R517.1
BUFF_OUT18: R518.1
BUFF_OUT19: R519.1
BUFF_OUT20: R520.1
LOAD1: K501.5
LOAD2: K502.5
LOAD3: K503.5
LOAD4: K504.5
LOAD5: K505.5
LOAD6: K506.5
LOAD7: K507.5
LOAD8: K508.5
LOAD9: K509.5
LOAD10: K510.5
LOAD11: K511.5
LOAD12: K512.5
LOAD13: K513.5
LOAD14: K514.5
LOAD15: K515.5
LOAD16: K516.5
LOAD17: K517.5
LOAD18: K518.5
LOAD19: K519.5
LOAD20: K520.5
SSR_A1: K501.1 R501.2
SSR_A2: K502.1 R502.2
SSR_A3: K503.1 R503.2
SSR_A4: K504.1 R504.2
SSR_A5: K505.1 R505.2
SSR_A6: K506.1 R506.2
SSR_A7: K507.1 R507.2
SSR_A8: K508.1 R508.2
SSR_A9: K509.1 R509.2
SSR_A10: K510.1 R510.2
SSR_A11: K511.1 R511.2
SSR_A12: K512.1 R512.2
SSR_A13: K513.1 R513.2
SSR_A14: K514.1 R514.2
SSR_A15: K515.1 R515.2
SSR_A16: K516.1 R516.2
SSR_A17: K517.1 R517.2
SSR_A18: K518.1 R518.2
SSR_A19: K519.1 R519.2
SSR_A20: K520.1 R520.2

Not connected (* = marked no-connect by the designer): K501 3*; K502 3*; K503 3*; K504 3*; K505 3*; K506 3*; K507 3*; K508 3*; K509 3*; K510 3*; K511 3*; K512 3*; K513 3*; K514 3*; K515 3*; K516 3*; K517 3*; K518 3*; K519 3*; K520 3*

### Notes on the sheet
- Controller A20
- [5] MOSFET SSRs

### Library data of the parts
K501-K520 = G3VM-61BR2 60V 4/8 A SSR: 2.5kV 60V 1.64V DIP-6 Solid State Relays (SSR) RoHS; Manufacturer: Omron Electronics Inc-EMC Div; Qty.: 1; Ext. Price: 10.71; Mfr. Part #: G3VM-61BR2; Supplier: DigiKey; Supplier Part #: 39-G3VM-61BR2-ND; Package: DIP-6; Unit Price: 10.71; ComponentLink1Description: Datasheet; ComponentLink1URL: https://mm.digikey.com/Volume0/opasdata/d220001/medias/docus/311/G3VM-zBRzzzERzz_DS.pdf; ComponentLink2Description: Distributor Link; ComponentLink2URL: https://www.digikey.com/en/products/detail/omron-electronics-inc-emc-div/G3VM-61BR2/9920126?s=N4IgTCBcDaIOIGYBqBZAtANgIwCEBKEAugL5A
R501-R520 = RES 470R: as R314 on sheet (3) Controller A20_Ethernet; Supplier: DigiKey; Supplier Part #: YAG5742CT-ND; Package: 0603; Unit Price: 0.01; ComponentLink1Description: Datasheet; ComponentLink1URL: https://www.yageogroup.com/content/datasheet/asset/file/PYU-RT_1-TO-0-01_ROHS_L; ComponentLink2Description: Distributor Link; ComponentLink2URL: https://www.digikey.com/en/products/detail/yageo/RT0603FRE07470RL/1075383

## Sheet (6) Controller A20_OUTPUT.SchDoc
size 355 x 304 mm; SheetNumber: 6; SheetTotal: 6
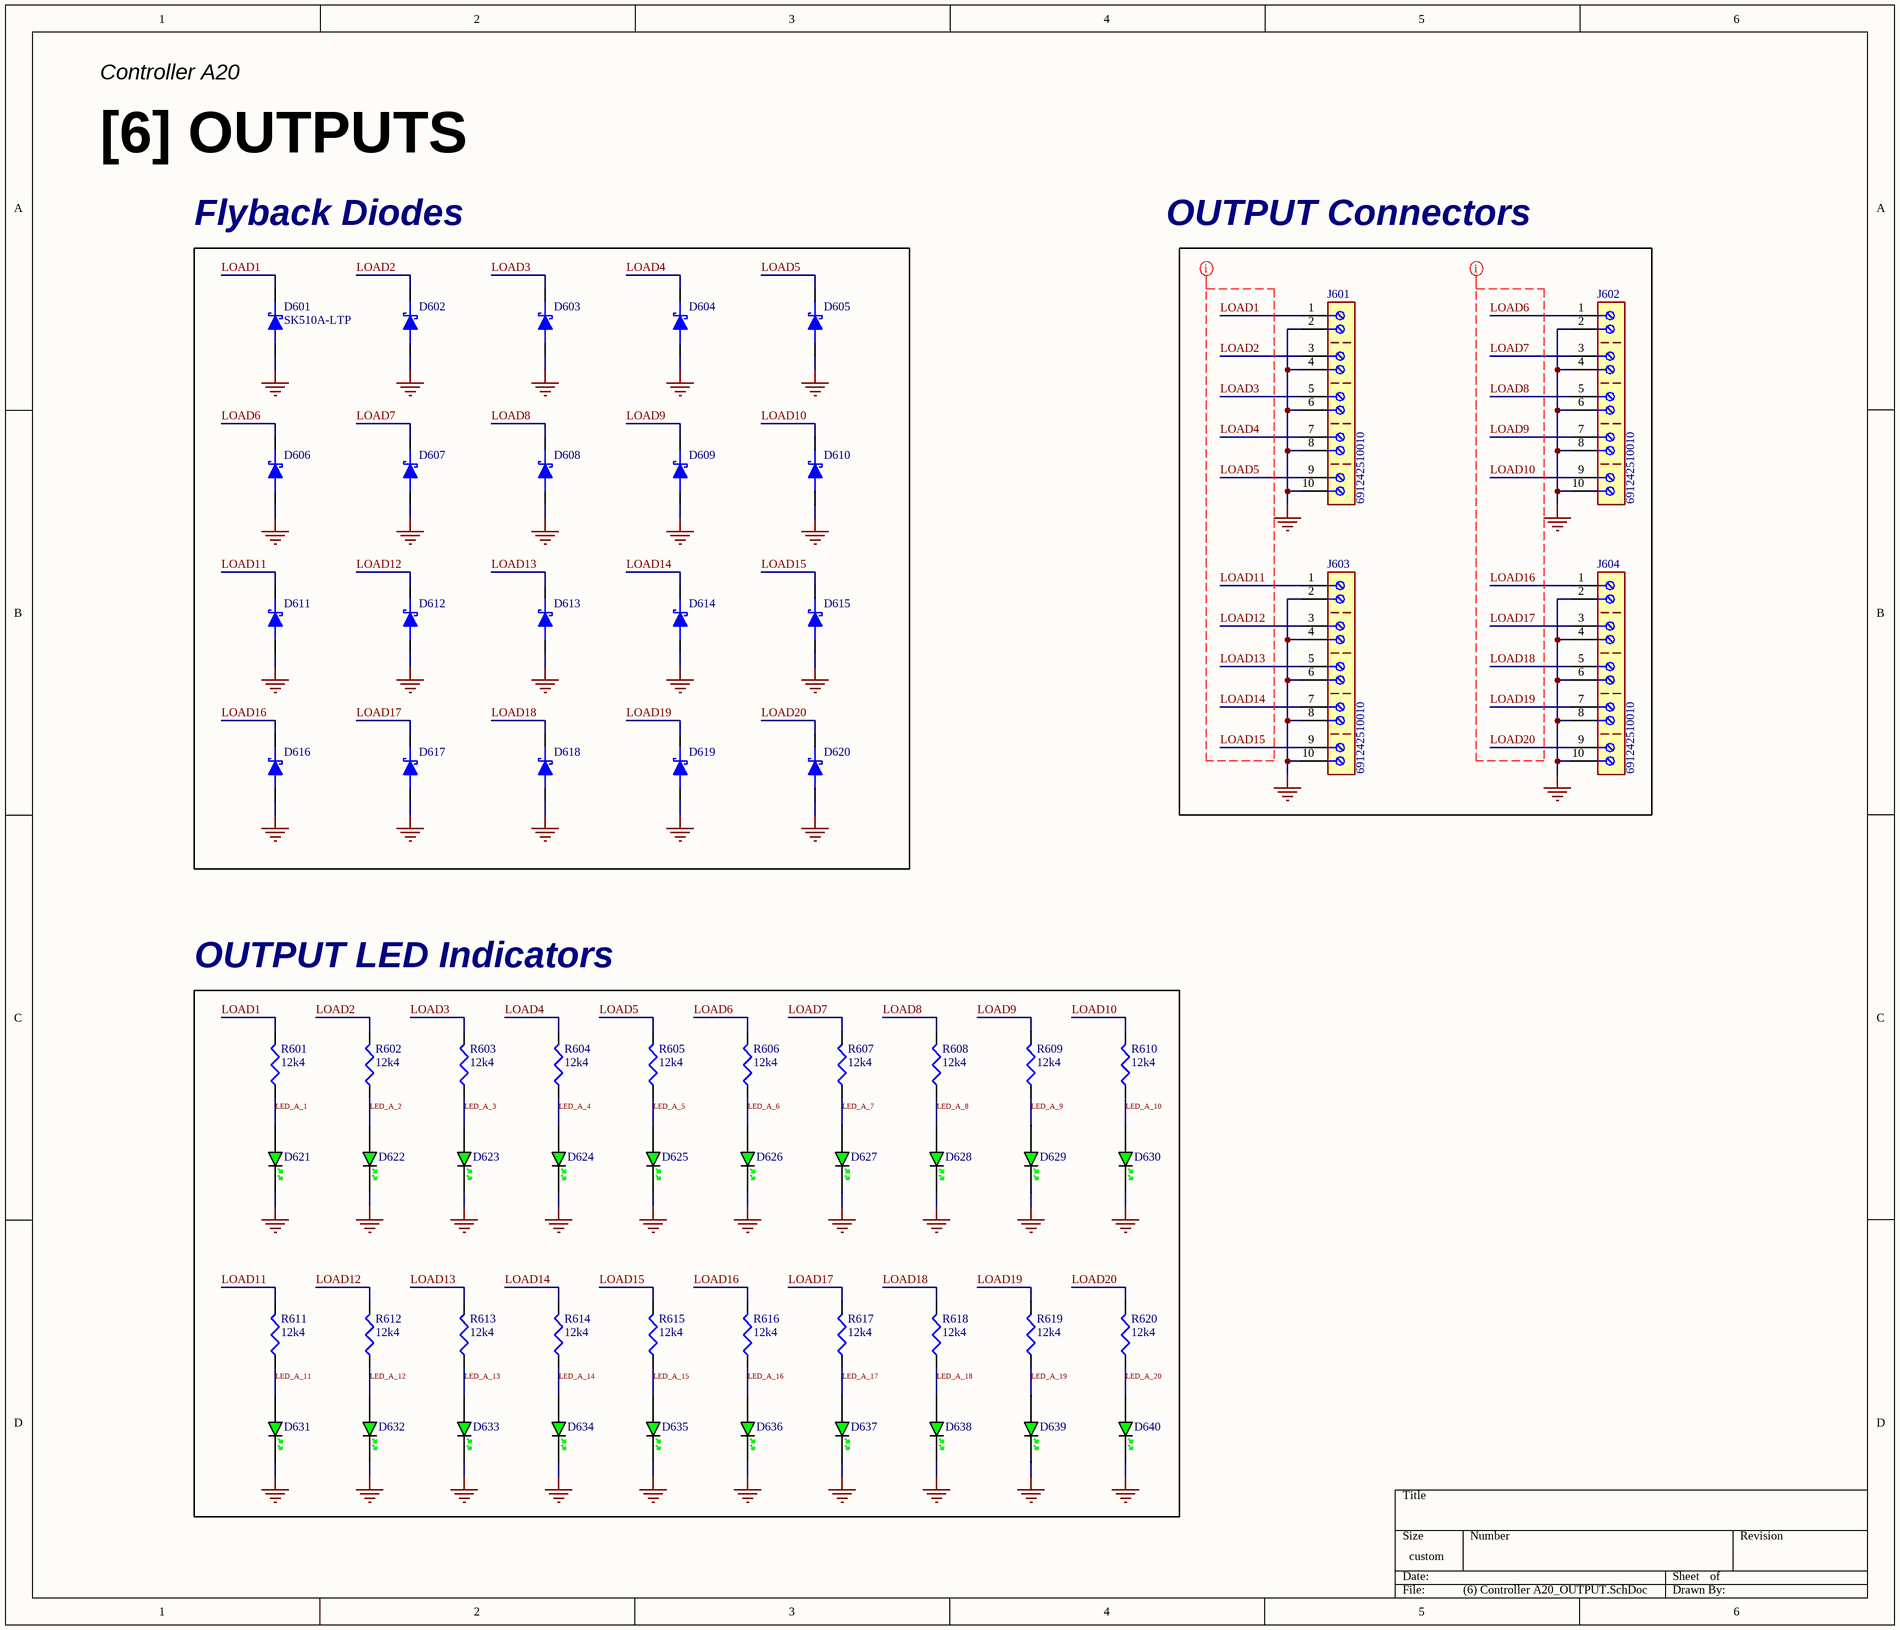
[diagram p5: (6) Controller A20_OUTPUT.SchDoc]

### Parts
D601  SK510A-LTP  [DO-214AC(SMA)]
D602  SK510A-LTP  [DO-214AC(SMA)]  (value not drawn)
D603  SK510A-LTP  [DO-214AC(SMA)]  (value not drawn)
D604  SK510A-LTP  [DO-214AC(SMA)]  (value not drawn)
D605  SK510A-LTP  [DO-214AC(SMA)]  (value not drawn)
D606  SK510A-LTP  [DO-214AC(SMA)]  (value not drawn)
D607  SK510A-LTP  [DO-214AC(SMA)]  (value not drawn)
D608  SK510A-LTP  [DO-214AC(SMA)]  (value not drawn)
D609  SK510A-LTP  [DO-214AC(SMA)]  (value not drawn)
D610  SK510A-LTP  [DO-214AC(SMA)]  (value not drawn)
D611  SK510A-LTP  [DO-214AC(SMA)]  (value not drawn)
D612  SK510A-LTP  [DO-214AC(SMA)]  (value not drawn)
D613  SK510A-LTP  [DO-214AC(SMA)]  (value not drawn)
D614  SK510A-LTP  [DO-214AC(SMA)]  (value not drawn)
D615  SK510A-LTP  [DO-214AC(SMA)]  (value not drawn)
D616  SK510A-LTP  [DO-214AC(SMA)]  (value not drawn)
D617  SK510A-LTP  [DO-214AC(SMA)]  (value not drawn)
D618  SK510A-LTP  [DO-214AC(SMA)]  (value not drawn)
D619  SK510A-LTP  [DO-214AC(SMA)]  (value not drawn)
D620  SK510A-LTP  [DO-214AC(SMA)]  (value not drawn)
D621  XL-2012UGC  [0805 G LED]  (value not drawn)
D622  XL-2012UGC  [0805 G LED]  (value not drawn)
D623  XL-2012UGC  [0805 G LED]  (value not drawn)
D624  XL-2012UGC  [0805 G LED]  (value not drawn)
D625  XL-2012UGC  [0805 G LED]  (value not drawn)
D626  XL-2012UGC  [0805 G LED]  (value not drawn)
D627  XL-2012UGC  [0805 G LED]  (value not drawn)
D628  XL-2012UGC  [0805 G LED]  (value not drawn)
D629  XL-2012UGC  [0805 G LED]  (value not drawn)
D630  XL-2012UGC  [0805 G LED]  (value not drawn)
D631  XL-2012UGC  [0805 G LED]  (value not drawn)
D632  XL-2012UGC  [0805 G LED]  (value not drawn)
D633  XL-2012UGC  [0805 G LED]  (value not drawn)
D634  XL-2012UGC  [0805 G LED]  (value not drawn)
D635  XL-2012UGC  [0805 G LED]  (value not drawn)
D636  XL-2012UGC  [0805 G LED]  (value not drawn)
D637  XL-2012UGC  [0805 G LED]  (value not drawn)
D638  XL-2012UGC  [0805 G LED]  (value not drawn)
D639  XL-2012UGC  [0805 G LED]  (value not drawn)
D640  XL-2012UGC  [0805 G LED]  (value not drawn)
J601  691242510010  [5.08mm 10P STB]
J602  691242510010  [5.08mm 10P STB]
J603  691242510010  [5.08mm 10P STB]
J604  691242510010  [5.08mm 10P STB]
R601  12k4  [R0603]
R602  12k4  [R0603]
R603  12k4  [R0603]
R604  12k4  [R0603]
R605  12k4  [R0603]
R606  12k4  [R0603]
R607  12k4  [R0603]
R608  12k4  [R0603]
R609  12k4  [R0603]
R610  12k4  [R0603]
R611  12k4  [R0603]
R612  12k4  [R0603]
R613  12k4  [R0603]
R614  12k4  [R0603]
R615  12k4  [R0603]
R616  12k4  [R0603]
R617  12k4  [R0603]
R618  12k4  [R0603]
R619  12k4  [R0603]
R620  12k4  [R0603]

### Blocks framed on the sheet
Flyback Diodes: D601-D620
OUTPUT LED Indicators: D621-D640 R601-R620

### Nets
GND: D601.1 D602.1 D603.1 D604.1 D605.1 D606.1 D607.1 D608.1 D609.1 D610.1 D611.1 D612.1 D613.1 D614.1 D615.1 D616.1 D617.1 D618.1 D619.1 D620.1 D621.2 D622.2 D623.2 D624.2 D625.2 D626.2 D627.2 D628.2 D629.2 D630.2 D631.2 D632.2 D633.2 D634.2 D635.2 D636.2 D637.2 D638.2 D639.2 D640.2 J601.2 J601.4 J601.6 J601.8 J601.10 J602.2 J602.4 J602.6 J602.8 J602.10 J603.2 J603.4 J603.6 J603.8 J603.10 J604.2 J604.4 J604.6 J604.8 J604.10
LED_A_1: D621.1 R601.1
LED_A_2: D622.1 R602.1
LED_A_3: D623.1 R603.1
LED_A_4: D624.1 R604.1
LED_A_5: D625.1 R605.1
LED_A_6: D626.1 R606.1
LED_A_7: D627.1 R607.1
LED_A_8: D628.1 R608.1
LED_A_9: D629.1 R609.1
LED_A_10: D630.1 R610.1
LED_A_11: D631.1 R611.1
LED_A_12: D632.1 R612.1
LED_A_13: D633.1 R613.1
LED_A_14: D634.1 R614.1
LED_A_15: D635.1 R615.1
LED_A_16: D636.1 R616.1
LED_A_17: D637.1 R617.1
LED_A_18: D638.1 R618.1
LED_A_19: D639.1 R619.1
LED_A_20: D640.1 R620.1
LOAD1: D601.2 J601.1 R601.2
LOAD2: D602.2 J601.3 R602.2
LOAD3: D603.2 J601.5 R603.2
LOAD4: D604.2 J601.7 R604.2
LOAD5: D605.2 J601.9 R605.2
LOAD6: D606.2 J602.1 R606.2
LOAD7: D607.2 J602.3 R607.2
LOAD8: D608.2 J602.5 R608.2
LOAD9: D609.2 J602.7 R609.2
LOAD10: D610.2 J602.9 R610.2
LOAD11: D611.2 J603.1 R611.2
LOAD12: D612.2 J603.3 R612.2
LOAD13: D613.2 J603.5 R613.2
LOAD14: D614.2 J603.7 R614.2
LOAD15: D615.2 J603.9 R615.2
LOAD16: D616.2 J604.1 R616.2
LOAD17: D617.2 J604.3 R617.2
LOAD18: D618.2 J604.5 R618.2
LOAD19: D619.2 J604.7 R619.2
LOAD20: D620.2 J604.9 R620.2

### Layout directives
net class OUTPUTs: LOAD1, LOAD2, LOAD3, LOAD4, LOAD5, LOAD6, LOAD7, LOAD8, LOAD9, LOAD10, LOAD11, LOAD12, LOAD13, LOAD14, LOAD15, LOAD16, LOAD17, LOAD18, LOAD19, LOAD20

### Notes on the sheet
- Controller A20
- [6] OUTPUTS
- OUTPUT Connectors

### Library data of the parts
D601-D620 = SK510A-LTP 100V 5A Schottky Diode: as D201 on sheet (2) Controller A20_ESP32; Mfr. Part #: SK510A-LTP; Supplier: DigiKey; Supplier Part #: SK510A-LTPMSCT-ND; Package: DO-214AC(SMA); Unit Price: 0.5; ComponentLink1Description: Datasheet; ComponentLink1URL: https://www.mccsemi.com/pdf/Products/SK52A-L_SK5200A-L(SMA).pdf; ComponentLink2Description: Distributor Link; ComponentLink2URL: https://www.digikey.com/en/products/detail/mcc-micro-commercial-components/SK510A-LTP/5114130
D621-D640 = LED EMERALD: Green 525nm LED Indication - Discrete 2.9V 0805 (2012 Metric); Manufacturer: XINGLIGHT; Qty.: 3000; Ext. Price: 33.75; Mfr. Part #: XL-2012UGC; Supplier: DigiKey; Supplier Part #: 5962-XL-2012UGCTR-ND; Package: 0805; Unit Price: 0.01125; ComponentLink1Description: Datasheet; ComponentLink1URL: https://mm.digikey.com/Volume0/opasdata/d220001/medias/docus/6472/5962_XL-2012UGC%200805%E7%BF%A0%E7%BB%BF.pdf; ComponentLink2Description: Distributor Link; ComponentLink2URL: https://www.digikey.com/en/products/detail/xinglight/XL-2012UGC/25673312
J601-J604 = Terminal Block 10P 14A: 10 Position Wire to Board Terminal Block Horizontal with Board 0.200" (5.08mm) Through Hole; Manufacturer: Würth Elektronik; Qty.: 1; Ext. Price: 5.17; Mfr. Part #: 691242510010; Supplier: DigiKey; Supplier Part #: 732-691242510010-ND; Package: Through Hole, P=5.08mm; Unit Price: 5.17; ComponentLink1Description: Datasheet; ComponentLink1URL: https://www.we-online.com/components/products/datasheet/691242510010.pdf; ComponentLink2Description: Distributor Link; ComponentLink2URL: https://www.digikey.com/en/products/detail/w%C3%BCrth-elektronik/691242510010/11477533?s=N4IgTCBcDaIGwE4CMYAsYCsSAM2cgF0BfIA
R601-R620 = RES 12.4k: as R206 on sheet (2) Controller A20_ESP32; Supplier: DigiKey; Supplier Part #: 311-12.4KHRCT-ND; Package: 0603; Unit Price: 0.007; ComponentLink1Description: Datasheet; ComponentLink1URL: https://www.yageogroup.com/content/datasheet/asset/file/PYU-RT_1-TO-0-01_ROHS_L; ComponentLink2Description: Distributor Link; ComponentLink2URL: https://www.digikey.com/en/products/detail/yageo/RC0603FR-0712K4L/726917